# EAGLE design U96-SVM (EAGLE 9.6.2)

## Sheet 1 of 2
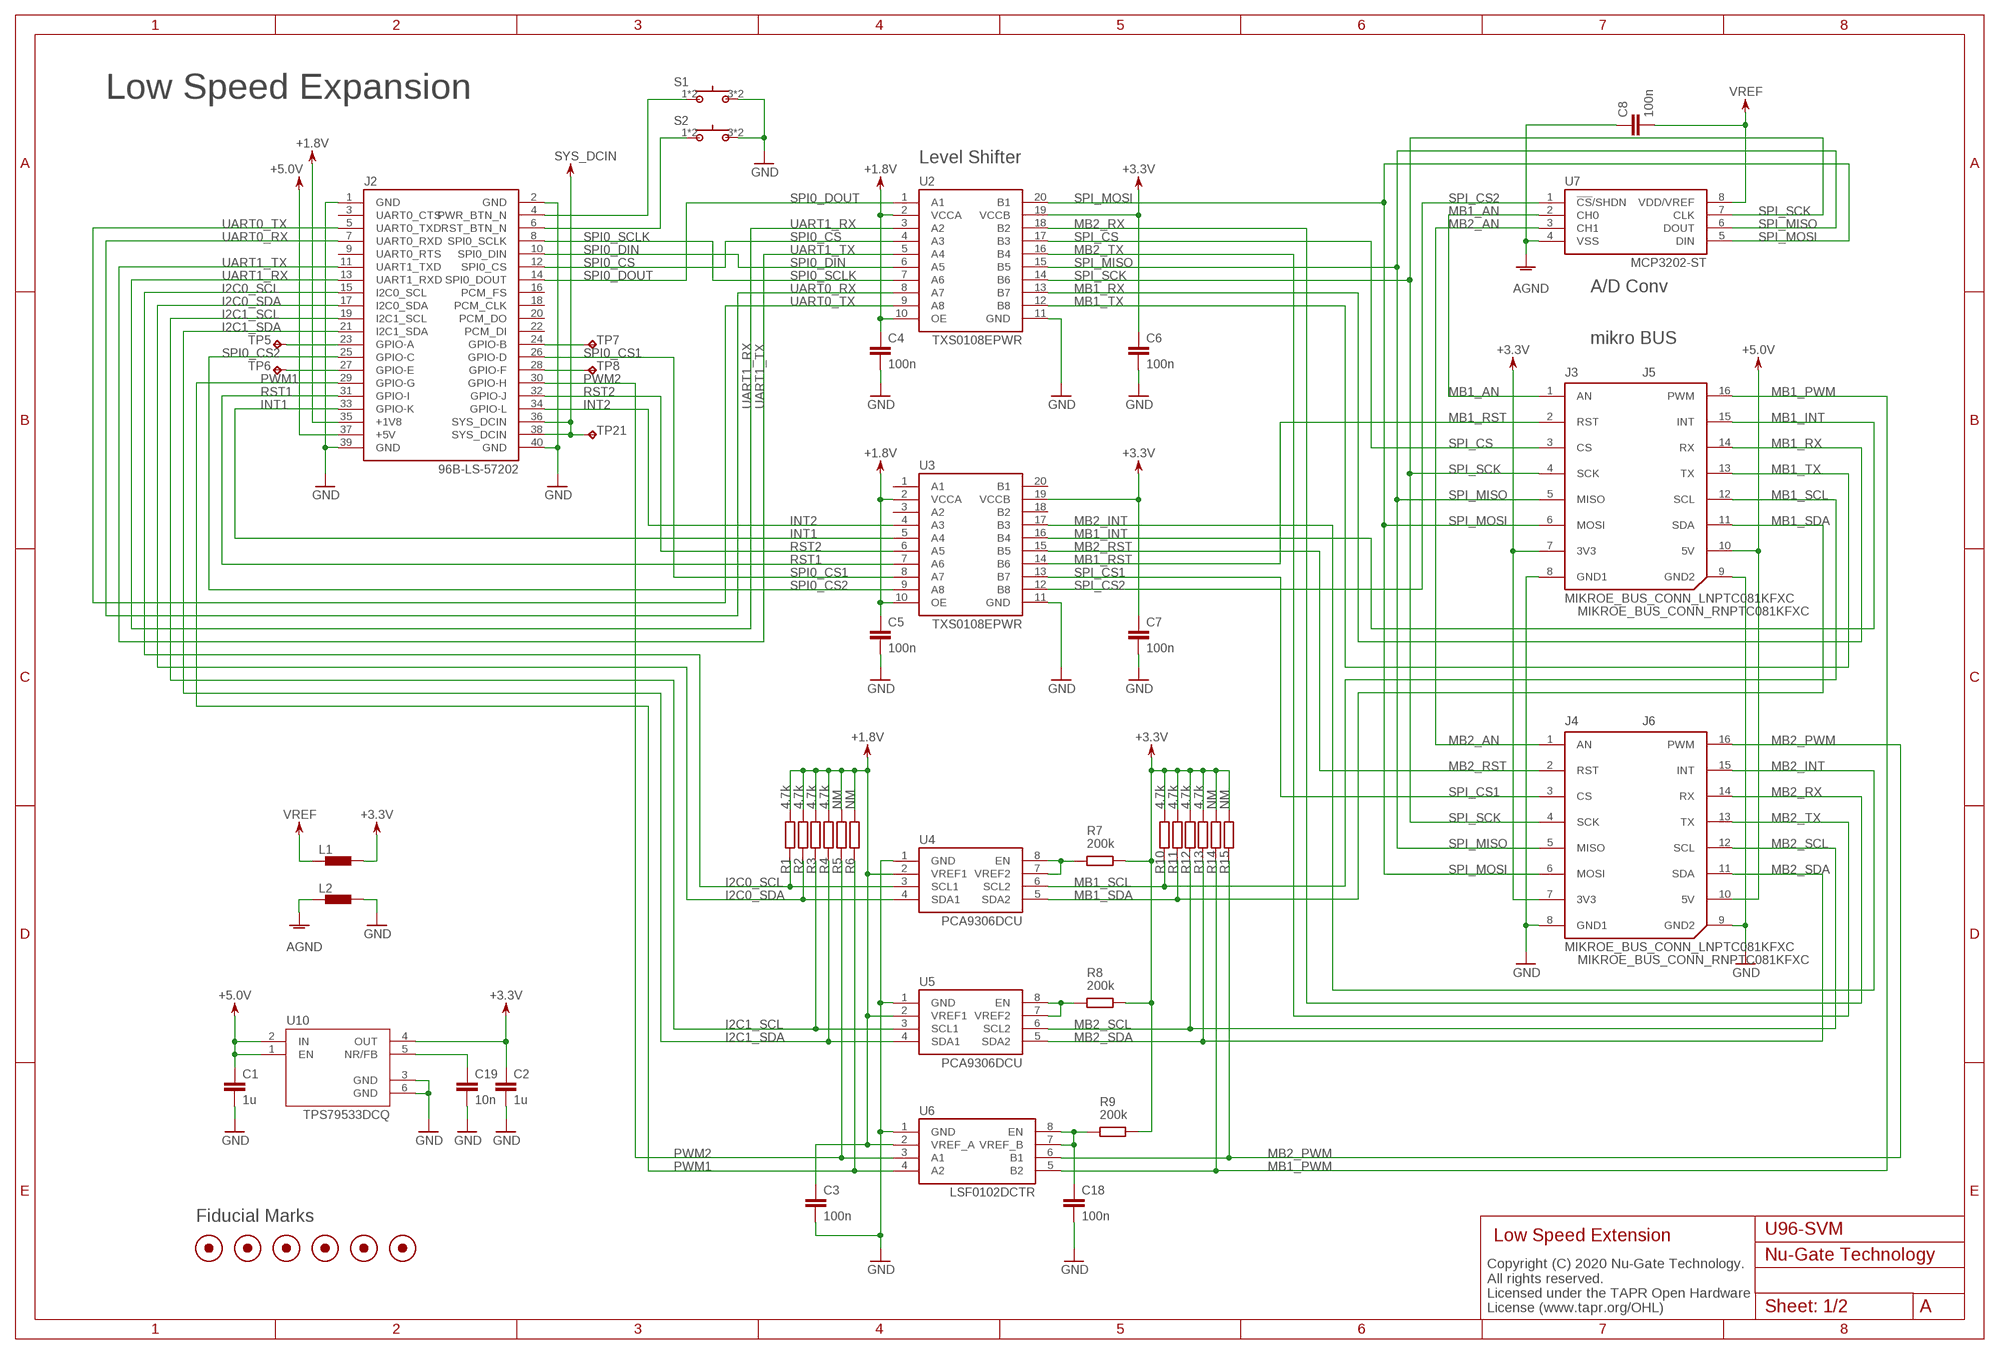
[diagram p0: schematic, sheet 1]
FRAME1 (A3L-LOC): EDITOR: Nu-Gate Technology; PAGE_TITLE: Low Speed Extension; PROJECT_NAME: U96-SVM; REV: A

### Parts
C1  1u  C-EUC0402  [C0402]
C2  1u  C-EUC0402  [C0402]
C3  100n  C-EUC0402  [C0402]
C4  100n  C-EUC0402  [C0402]
C5  100n  C-EUC0402  [C0402]
C6  100n  C-EUC0402  [C0402]
C7  100n  C-EUC0402  [C0402]
C8  100n  C-EUC0402  [C0402]
C18  100n  C-EUC0402  [C0402]
C19  10n  C-EUC0402  [C0402]
FID1  FIDUCIAL  [FIDUCIAL_1MM]
FID2  FIDUCIAL  [FIDUCIAL_1MM]
FID3  FIDUCIAL  [FIDUCIAL_1MM]
FID4  FIDUCIAL  [FIDUCIAL_1MM]
FID5  FIDUCIAL  [FIDUCIAL_1MM]
FID6  FIDUCIAL  [FIDUCIAL_1MM]
J2  96B-LS-57202  [57202-G52-20LF]
J3  MIKROE_BUS_CONN_LNPTC081KFXC  [MIKROBUS_HOST_CONN_L2]
J4  MIKROE_BUS_CONN_LNPTC081KFXC  [MIKROBUS_HOST_CONN_L2]
J5  MIKROE_BUS_CONN_RNPTC081KFXC  [MIKROBUS_HOST_CONN_R2]
J6  MIKROE_BUS_CONN_RNPTC081KFXC  [MIKROBUS_HOST_CONN_R2]
L1  BLM15AX  [0402]
L2  BLM15AX  [0402]
R1  4.7k  R-EU_R0402  [R0402]
R2  4.7k  R-EU_R0402  [R0402]
R3  4.7k  R-EU_R0402  [R0402]
R4  4.7k  R-EU_R0402  [R0402]
R5  NM  R-EU_R0402  [R0402]
R6  NM  R-EU_R0402  [R0402]
R7  200k  R-EU_R0402  [R0402]
R8  200k  R-EU_R0402  [R0402]
R9  200k  R-EU_R0402  [R0402]
R10  4.7k  R-EU_R0402  [R0402]
R11  4.7k  R-EU_R0402  [R0402]
R12  4.7k  R-EU_R0402  [R0402]
R13  4.7k  R-EU_R0402  [R0402]
R14  NM  R-EU_R0402  [R0402]
R15  NM  R-EU_R0402  [R0402]
S1  430181038816  [430181038816]
S2  430181038816  [430181038816]
TP5  TPB1,27  [B1,27]
TP6  TPB1,27  [B1,27]
TP7  TPB1,27  [B1,27]
TP8  TPB1,27  [B1,27]
TP21  TPB1,27  [B1,27]
U2  TXS0108EPWR  [TI-PW20]
U3  TXS0108EPWR  [TI-PW20]
U4  PCA9306DCU  [TI-DCU8]
U5  PCA9306DCU  [TI-DCU8]
U6  LSF0102DCTR  [TI-DCT8]
U7  MCP3202-ST  [MC-ST8]
U10  TPS79533DCQ  [TI-SOT223]

### Nets
+1.8V: C3.1 C4.1 C5.1 J2.35(+1V8) R1.2 R2.2 R3.2 R4.2 R5.2 R6.2 U2.2(VCCA) U2.10(OE) U3.2(VCCA) U3.10(OE) U4.2(VREF1) U5.2(VREF1) U6.2(VREF_A) ; also sheet 2
+3.3V: C2.1 C6.1 C7.1 J3.7(3V3) J4.7(3V3) L1.2 R7.2 R8.2 R9.2 R10.2 R11.2 R12.2 R13.2 R14.2 R15.2 U2.19(VCCB) U3.19(VCCB) U10.4(OUT) ; also sheet 2
+5.0V: C1.1 J2.37(+5V) J5.10(5V) J6.10(5V) U10.1(EN) U10.2(IN) ; also sheet 2
AGND: C8.1 L2.1 U7.4(VSS)
GND: C1.2 C2.2 C3.2 C4.2 C5.2 C6.2 C7.2 C18.2 C19.2 J2.1(GND) J2.2(GND) J2.39(GND) J2.40(GND) J3.8(GND1) J4.8(GND1) J5.9(GND2) J6.9(GND2) L2.2 S1.3 S1.4 S2.3 S2.4 U2.11(GND) U3.11(GND) U4.1(GND) U5.1(GND) U6.1(GND) U10.3(GND) U10.6(GND) ; also sheet 2
I2C0_SCL: J2.15(I2C0_SCL) R1.1 U4.3(SCL1)
I2C0_SDA: J2.17(I2C0_SDA) R2.1 U4.4(SDA1)
I2C1_SCL: J2.19(I2C1_SCL) R3.1 U5.3(SCL1)
I2C1_SDA: J2.21(I2C1_SDA) R4.1 U5.4(SDA1)
INT1: J2.33(GPIO-K) U3.5(A4)
INT2: J2.34(GPIO-L) U3.4(A3)
MB1_AN: J3.1(AN) U7.2(CH0)
MB1_INT: J5.15(INT) U3.16(B4)
MB1_PWM: J5.16(PWM) R14.1 U6.5(B2)
MB1_RST: J3.2(RST) U3.14(B6)
MB1_RX: J5.14(RX) U2.13(B7)
MB1_SCL: J5.12(SCL) R10.1 U4.6(SCL2)
MB1_SDA: J5.11(SDA) R11.1 U4.5(SDA2)
MB1_TX: J5.13(TX) U2.12(B8)
MB2_AN: J4.1(AN) U7.3(CH1)
MB2_INT: J6.15(INT) U3.17(B3)
MB2_PWM: J6.16(PWM) R15.1 U6.6(B1)
MB2_RST: J4.2(RST) U3.15(B5)
MB2_RX: J6.14(RX) U2.18(B2)
MB2_SCL: J6.12(SCL) R12.1 U5.6(SCL2)
MB2_SDA: J6.11(SDA) R13.1 U5.5(SDA2)
MB2_TX: J6.13(TX) U2.16(B4)
N$5: R7.1 U4.7(VREF2) U4.8(EN)
N$6: C18.1 R9.1 U6.7(VREF_B) U6.8(EN)
N$7: R8.1 U5.7(VREF2) U5.8(EN)
N$8: C19.1 U10.5(NR/FB)
N$10: J2.23(GPIO-A) TP5.TP
N$11: J2.4(PWR_BTN_N) S1.1 S1.2
N$12: J2.6(RST_BTN_N) S2.1 S2.2
N$13: J2.27(GPIO-E) TP6.TP
N$14: J2.24(GPIO-B) TP7.TP
N$15: J2.28(GPIO-F) TP8.TP
PWM1: J2.29(GPIO-G) R6.1 U6.4(A2)
PWM2: J2.30(GPIO-H) R5.1 U6.3(A1)
RST1: J2.31(GPIO-I) U3.7(A6)
RST2: J2.32(GPIO-J) U3.6(A5)
SPI0_CS: J2.12(SPI0_CS) U2.4(A3)
SPI0_CS1: J2.26(GPIO-D) U3.8(A7)
SPI0_CS2: J2.25(GPIO-C) U3.9(A8)
SPI0_DIN: J2.10(SPI0_DIN) U2.6(A5)
SPI0_DOUT: J2.14(SPI0_DOUT) U2.1(A1)
SPI0_SCLK: J2.8(SPI0_SCLK) U2.7(A6)
SPI_CS: J3.3(CS) U2.17(B3)
SPI_CS1: J4.3(CS) U3.13(B7)
SPI_CS2: U3.12(B8) U7.1(!CS!/SHDN)
SPI_MISO: J3.5(MISO) J4.5(MISO) U2.15(B5) U7.6(DOUT)
SPI_MOSI: J3.6(MOSI) J4.6(MOSI) U2.20(B1) U7.5(DIN)
SPI_SCK: J3.4(SCK) J4.4(SCK) U2.14(B6) U7.7(CLK)
SYS_DCIN: J2.36(SYS_DCIN) J2.38(SYS_DCIN) TP21.TP
UART0_RX: J2.7(UART0_RXD) U2.8(A7)
UART0_TX: J2.5(UART0_TXD) U2.9(A8)
UART1_RX: J2.13(UART1_RXD) U2.3(A2)
UART1_TX: J2.11(UART1_TXD) U2.5(A4)
VREF: C8.2 L1.1 U7.8(VDD/VREF)
Unconnected: J2.3(UART0_CTS) J2.9(UART0_RTS) J2.16(PCM_FS) J2.18(PCM_CLK) J2.20(PCM_DO) J2.22(PCM_DI) U3.1(A1) U3.3(A2) U3.18(B2) U3.20(B1)

### Notes on the sheet
- Low Speed Expansion
- Level Shifter
- A/D Conv
- mikro BUS
- Fiducial Marks
- Copyright (C) 2020 Nu-Gate Technology.
  All rights reserved.
  Licensed under the TAPR Open Hardware
  License (www.tapr.org/OHL)

## Sheet 2 of 2
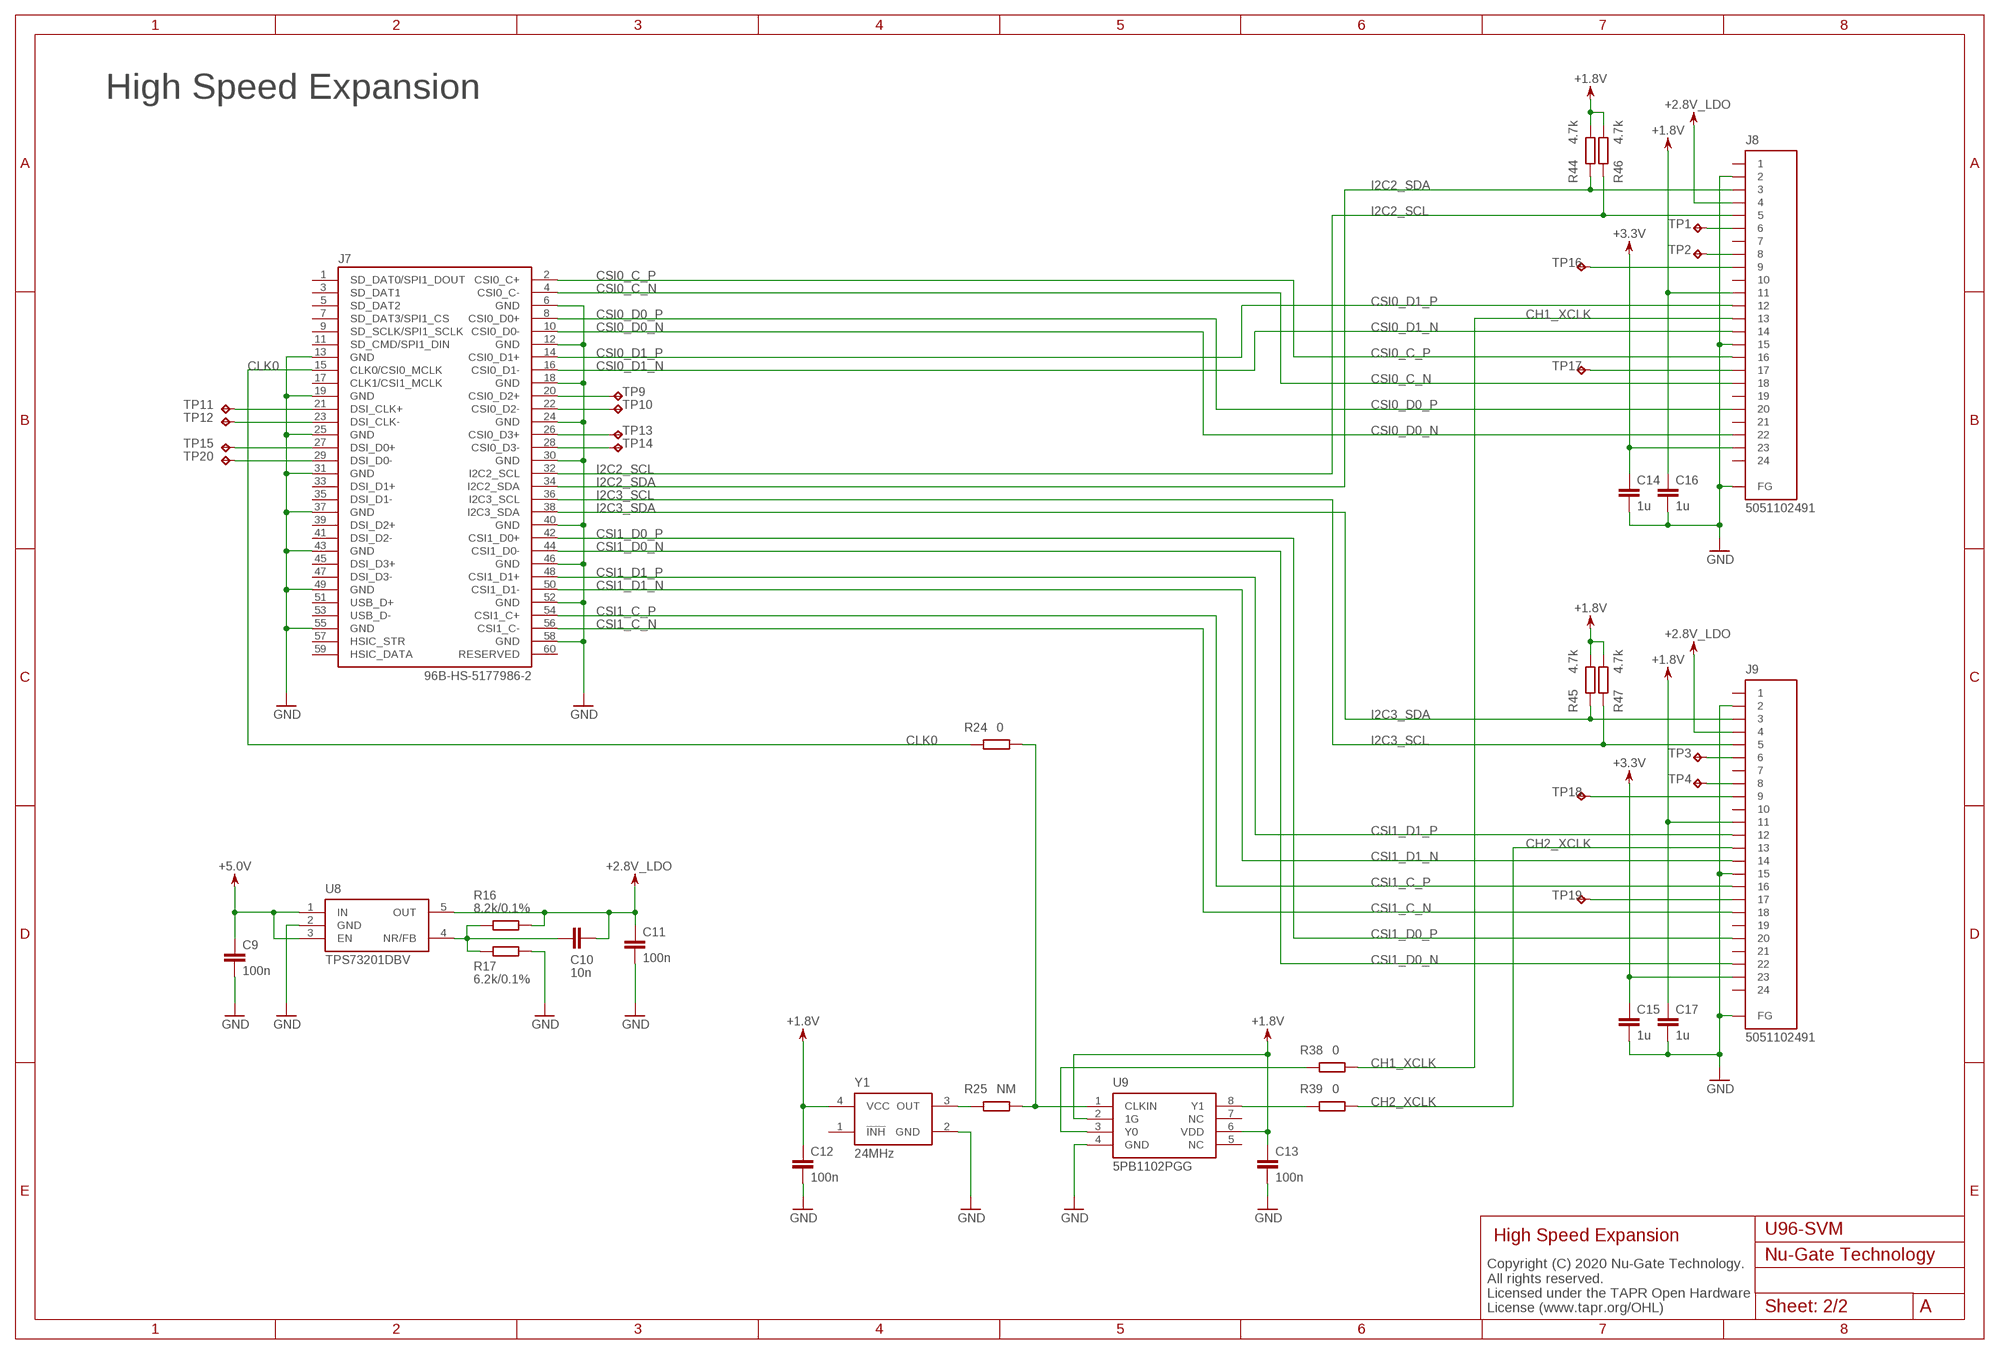
[diagram p1: schematic, sheet 2]
FRAME3 (A3L-LOC): EDITOR: Nu-Gate Technology; PAGE_TITLE: High Speed Expansion; PROJECT_NAME: U96-SVM; REV: A

### Parts
C9  100n  C-EUC0402  [C0402]
C10  10n  C-EUC0402  [C0402]
C11  100n  C-EUC0402  [C0402]
C12  100n  C-EUC0402  [C0402]
C13  100n  C-EUC0402  [C0402]
C14  1u  C-EUC0402  [C0402]
C15  1u  C-EUC0402  [C0402]
C16  1u  C-EUC0402  [C0402]
C17  1u  C-EUC0402  [C0402]
J7  96B-HS-5177986-2  [5177986-2]
J8  5051102491  [MO-5051102491]
J9  5051102491  [MO-5051102491]
R16  8.2k/0.1%  R-EU_R0402  [R0402]
R17  6.2k/0.1%  R-EU_R0402  [R0402]
R24  0  R-EU_R0402  [R0402]
R25  NM  R-EU_R0402  [R0402]
R38  0  R-EU_R0402  [R0402]
R39  0  R-EU_R0402  [R0402]
R44  4.7k  R-EU_R0402  [R0402]
R45  4.7k  R-EU_R0402  [R0402]
R46  4.7k  R-EU_R0402  [R0402]
R47  4.7k  R-EU_R0402  [R0402]
TP1  TPB1,27  [B1,27]
TP2  TPB1,27  [B1,27]
TP3  TPB1,27  [B1,27]
TP4  TPB1,27  [B1,27]
TP9  TPB1,27  [B1,27]
TP10  TPB1,27  [B1,27]
TP11  TPB1,27  [B1,27]
TP12  TPB1,27  [B1,27]
TP13  TPB1,27  [B1,27]
TP14  TPB1,27  [B1,27]
TP15  TPB1,27  [B1,27]
TP16  TPB1,27  [B1,27]
TP17  TPB1,27  [B1,27]
TP18  TPB1,27  [B1,27]
TP19  TPB1,27  [B1,27]
TP20  TPB1,27  [B1,27]
U8  TPS73201DBV  [TI-SOT23]
U9  5PB1102PGG  [ID-TSSOP8]
Y1  24MHz  KC2520Z  [KC2520Z]

### Nets
+1.8V: C12.1 C13.1 C16.1 C17.1 J8.11 J9.11 R44.2 R45.2 R46.2 R47.2 U9.2(1G) U9.6(VDD) Y1.4(VCC) ; also sheet 1
+2.8V_LDO: C10.2 C11.1 J8.4 J9.4 R16.2 U8.5(OUT)
+3.3V: C14.1 C15.1 J8.23 J9.23 ; also sheet 1
+5.0V: C9.1 U8.1(IN) U8.3(EN) ; also sheet 1
CH1_XCLK: J8.13 R38.2
CH2_XCLK: J9.13 R39.2
CLK0: J7.15(CLK0/CSI0_MCLK) R24.1
CSI0_C_N [lvds]: J7.4(CSI0_C-) J8.18
CSI0_C_P [lvds]: J7.2(CSI0_C+) J8.16
CSI0_D0_N [lvds]: J7.10(CSI0_D0-) J8.22
CSI0_D0_P [lvds]: J7.8(CSI0_D0+) J8.20
CSI0_D1_N [lvds]: J7.16(CSI0_D1-) J8.14
CSI0_D1_P [lvds]: J7.14(CSI0_D1+) J8.12
CSI1_C_N [lvds]: J7.56(CSI1_C-) J9.18
CSI1_C_P [lvds]: J7.54(CSI1_C+) J9.16
CSI1_D0_N [lvds]: J7.44(CSI1_D0-) J9.22
CSI1_D0_P [lvds]: J7.42(CSI1_D0+) J9.20
CSI1_D1_N [lvds]: J7.50(CSI1_D1-) J9.14
CSI1_D1_P [lvds]: J7.48(CSI1_D1+) J9.12
GND: C9.2 C11.2 C12.2 C13.2 C14.2 C15.2 C16.2 C17.2 J7.6(GND) J7.12(GND) J7.13(GND) J7.18(GND) J7.19(GND) J7.24(GND) J7.25(GND) J7.30(GND) J7.31(GND) J7.37(GND) J7.40(GND) J7.43(GND) J7.46(GND) J7.49(GND) J7.52(GND) J7.55(GND) J7.58(GND) J8.2 J8.15 J8.FG@1(FG) J8.FG@2(FG) J9.2 J9.15 J9.FG@1(FG) J9.FG@2(FG) R17.2 U8.2(GND) U9.4(GND) Y1.2(GND) ; also sheet 1
I2C2_SCL: J7.32(I2C2_SCL) J8.5 R46.1
I2C2_SDA: J7.34(I2C2_SDA) J8.3 R44.1
I2C3_SCL: J7.36(I2C3_SCL) J9.5 R47.1
I2C3_SDA: J7.38(I2C3_SDA) J9.3 R45.1
N$1: J8.6 TP1.TP
N$2: J8.8 TP2.TP
N$3: J9.6 TP3.TP
N$4: J9.8 TP4.TP
N$9: C10.1 R16.1 R17.1 U8.4(NR/FB)
N$16: J7.21(DSI_CLK+) TP11.TP
N$17: J7.23(DSI_CLK-) TP12.TP
N$18: J7.27(DSI_D0+) TP15.TP
N$19: J7.29(DSI_D0-) TP20.TP
N$20: J7.20(CSI0_D2+) TP9.TP
N$21: J7.22(CSI0_D2-) TP10.TP
N$22: J7.26(CSI0_D3+) TP13.TP
N$23: J7.28(CSI0_D3-) TP14.TP
N$37: R25.1 Y1.3(OUT)
N$38: R24.2 R25.2 U9.1(CLKIN)
N$39: R39.1 U9.8(Y1)
N$40: R38.1 U9.3(Y0)
N$59: J8.9 TP16.TP
N$60: J8.17 TP17.TP
N$61: J9.9 TP18.TP
N$62: J9.17 TP19.TP
Unconnected: J7.1(SD_DAT0/SPI1_DOUT) J7.3(SD_DAT1) J7.5(SD_DAT2) J7.7(SD_DAT3/SPI1_CS) J7.9(SD_SCLK/SPI1_SCLK) J7.11(SD_CMD/SPI1_DIN) J7.17(CLK1/CSI1_MCLK) J7.33(DSI_D1+) J7.35(DSI_D1-) J7.39(DSI_D2+) J7.41(DSI_D2-) J7.45(DSI_D3+) J7.47(DSI_D3-) J7.51(USB_D+) J7.53(USB_D-) J7.57(HSIC_STR) J7.59(HSIC_DATA) J7.60(RESERVED) J8.1 J8.7 J8.10 J8.19 J8.21 J8.24 J9.1 J9.7 J9.10 J9.19 J9.21 J9.24 U9.5(NC) U9.7(NC) Y1.1(!INH)

### Notes on the sheet
- High Speed Expansion
- Copyright (C) 2020 Nu-Gate Technology.
  All rights reserved.
  Licensed under the TAPR Open Hardware
  License (www.tapr.org/OHL)

## Library data of the parts
C1-C19 = rcl:C-EU: CAPACITOR, European symbol; SPICEPREFIX: C
FID1-FID6 = U96-SVM:FIDUCIAL: For use by pick and place machines to calibrate the vision/machine, 1mm By microbuilder.eu
J2 = U96-SVM:96B-LS-57202
J3 J4 = U96-SVM:MIKROE_BUS_CONN_L
J5 J6 = U96-SVM:MIKROE_BUS_CONN_R
J7 = U96-SVM:96B-HS-5177986-2
J8 J9 = U96-SVM:5051102491: 0.5mm pitch, 24 circuit FPC connector
L1 L2 = U96-SVM:BLM15: EMIFIL (R) Chip Ferrite Bead for GHz Noise Source: http://www.murata.com/ Ferrite Bead BLM15H.pdf
R1-R17 R24 R25 R38 R39 R44-R47 = rcl:R-EU_: RESISTOR, European symbol; SPICEPREFIX: R
S1 S2 = U96-SVM:430181038816: 4.5x4.5 mm SMD WS-TASV <http://katalog.we-online.de/media/images/v2/Family_WS-TASV_SMD_Tact_Switch_430181038816.jpg> Details see: http://katalog.we-online.de/en/em/TASV_4_5X4_5_SMD/430181038816
TP1-TP21 = testpad:TP: Test pad
U2 U3 = U96-SVM:TXS0108EPWR
U4 U5 = U96-SVM:PCA9306DCU
U6 = U96-SVM:LSF0102DCTR
U7 = U96-SVM:MCP3202-ST
U8 = U96-SVM:TPS732*DBV: LDO 250mA TPS732xx yyy z xx: nominal output voltage (25 = 2.5V; 01 = adjustable) yyy: package designator (DBV = SOT-23) z: tape and reel quantity (R = 3000, T = 250)
U9 = U96-SVM:5PB1102PGG: IDT 1.8V to 3.3V LVCMOS Clock Buffer
U10 = U96-SVM:TPS79533DCQ
Y1 = U96-SVM:KC2520Z

## Net classes
1 lvds: width 0.32 mm, drill 0.25 mm, clearance 0.18 mm

## Board
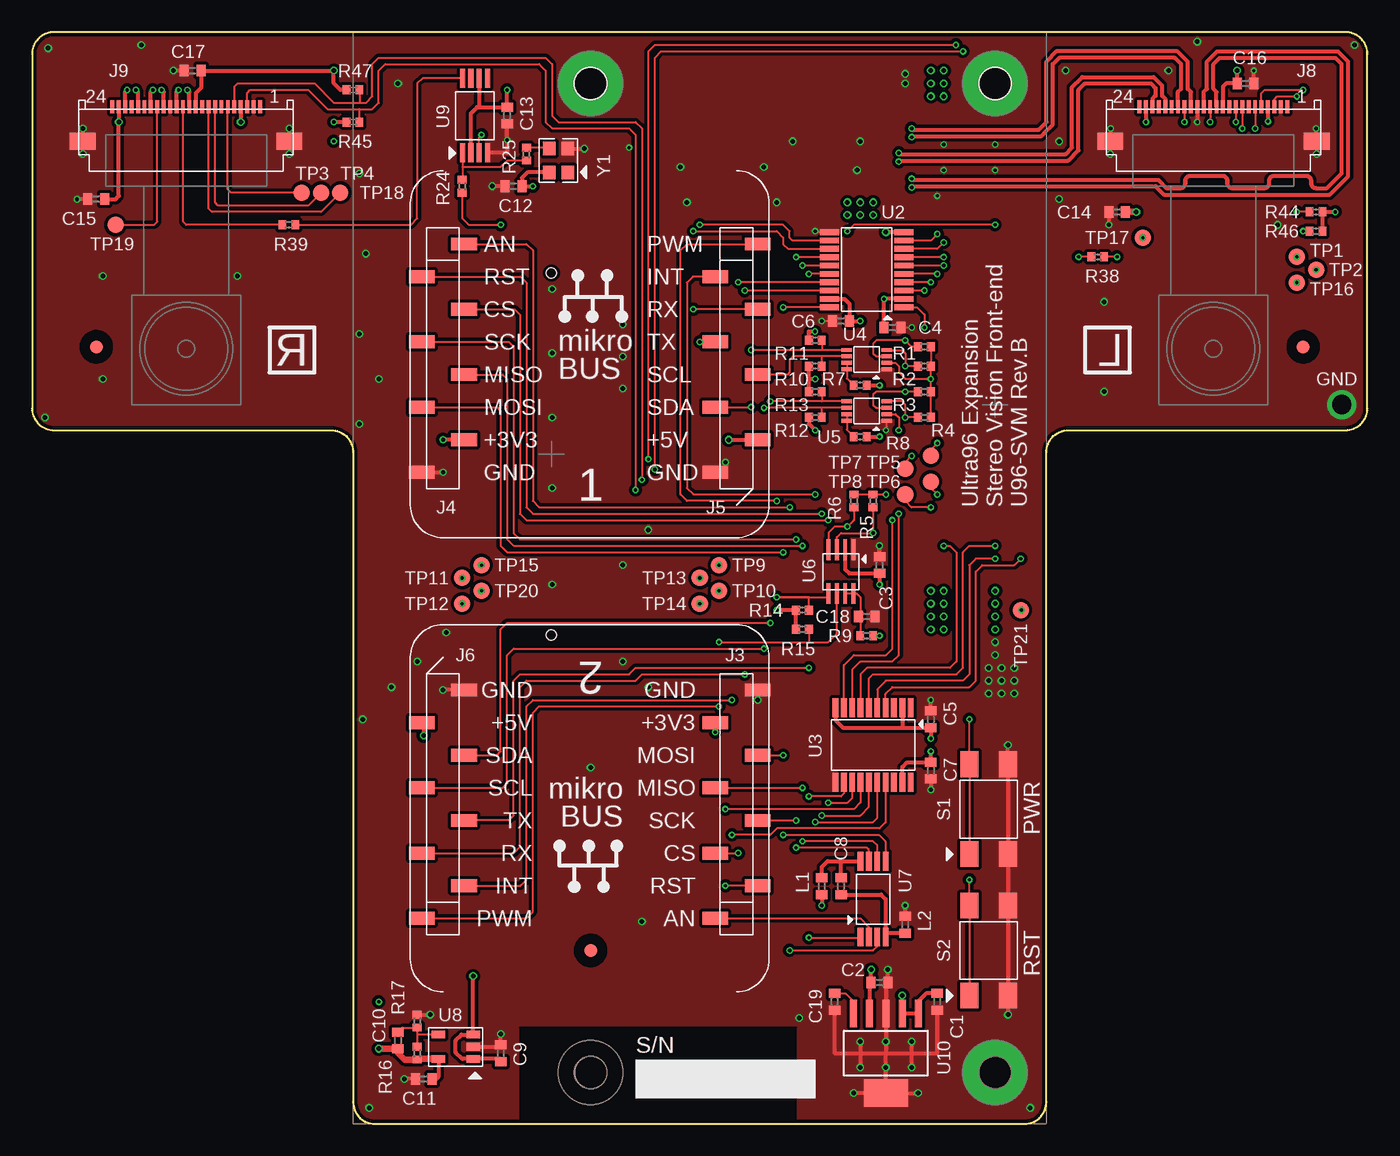
[diagram p2: board, top side]
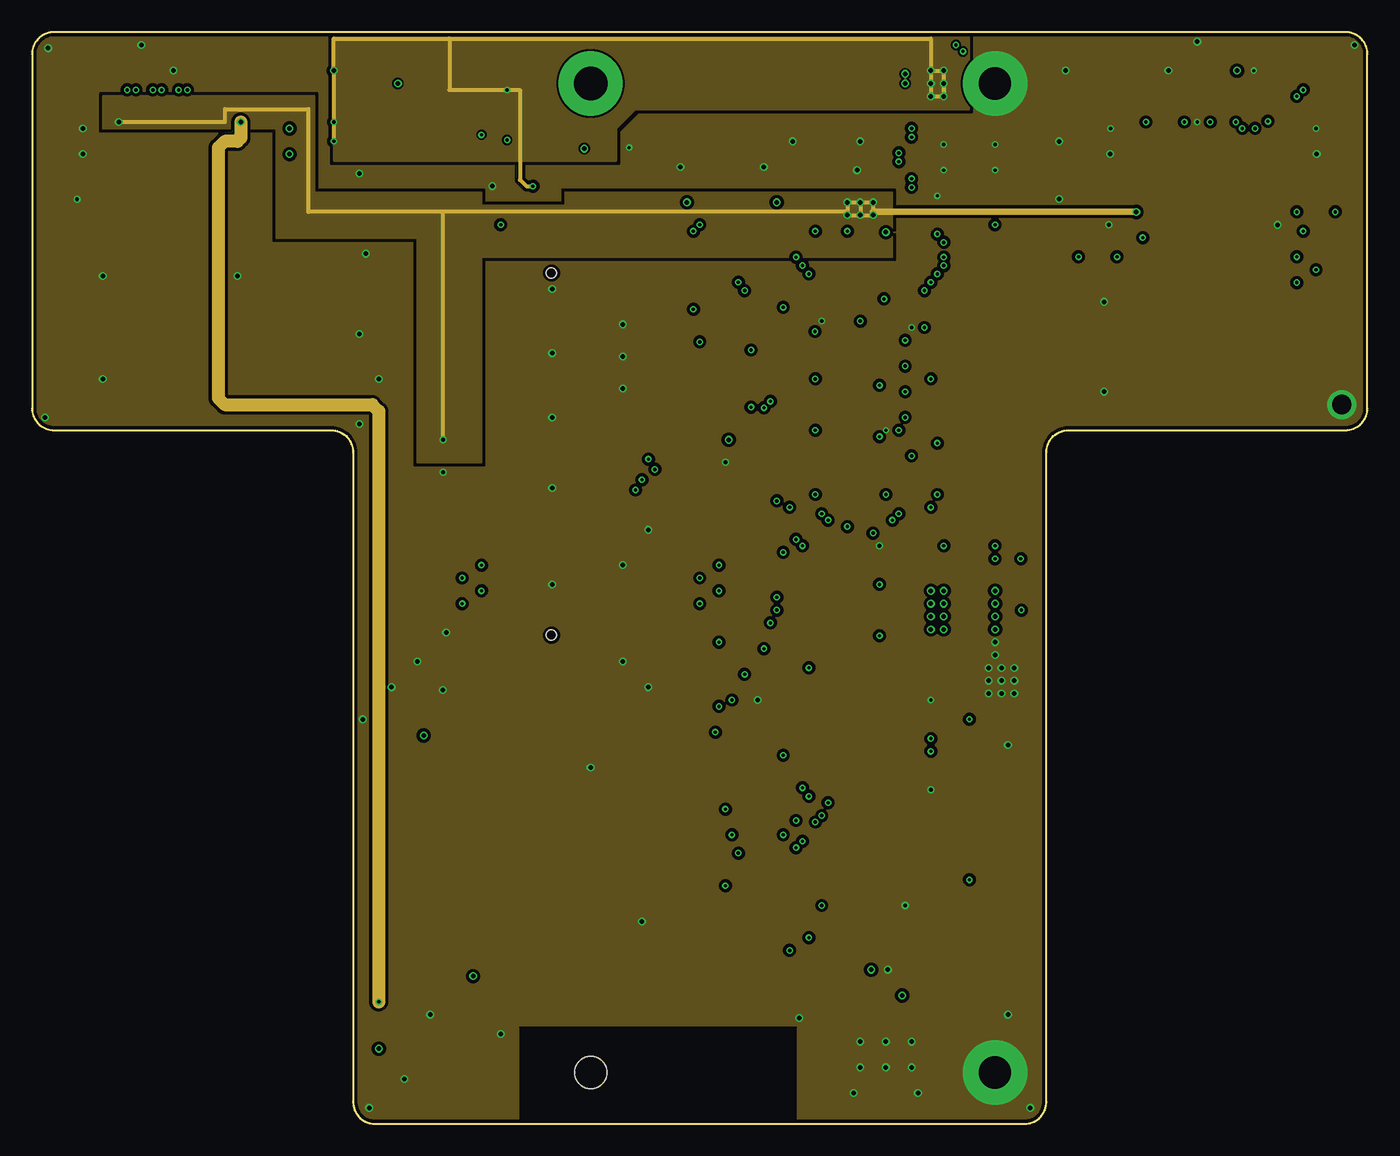
[diagram p3: board, inner layer Route2]
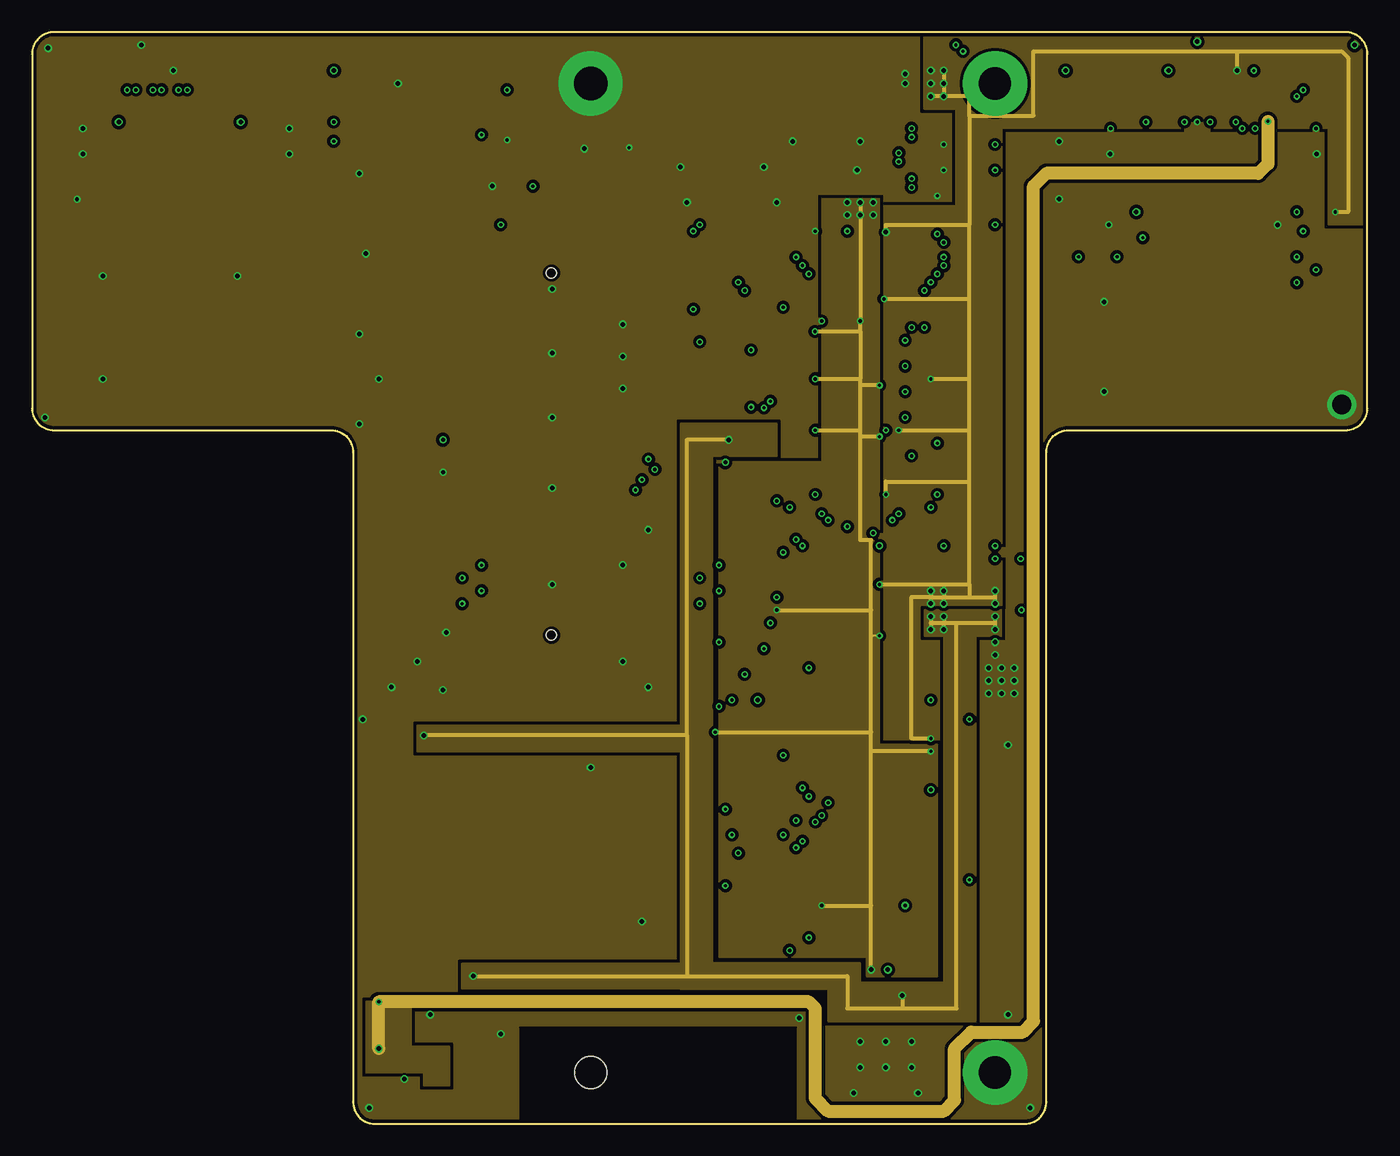
[diagram p4: board, inner layer Route3]
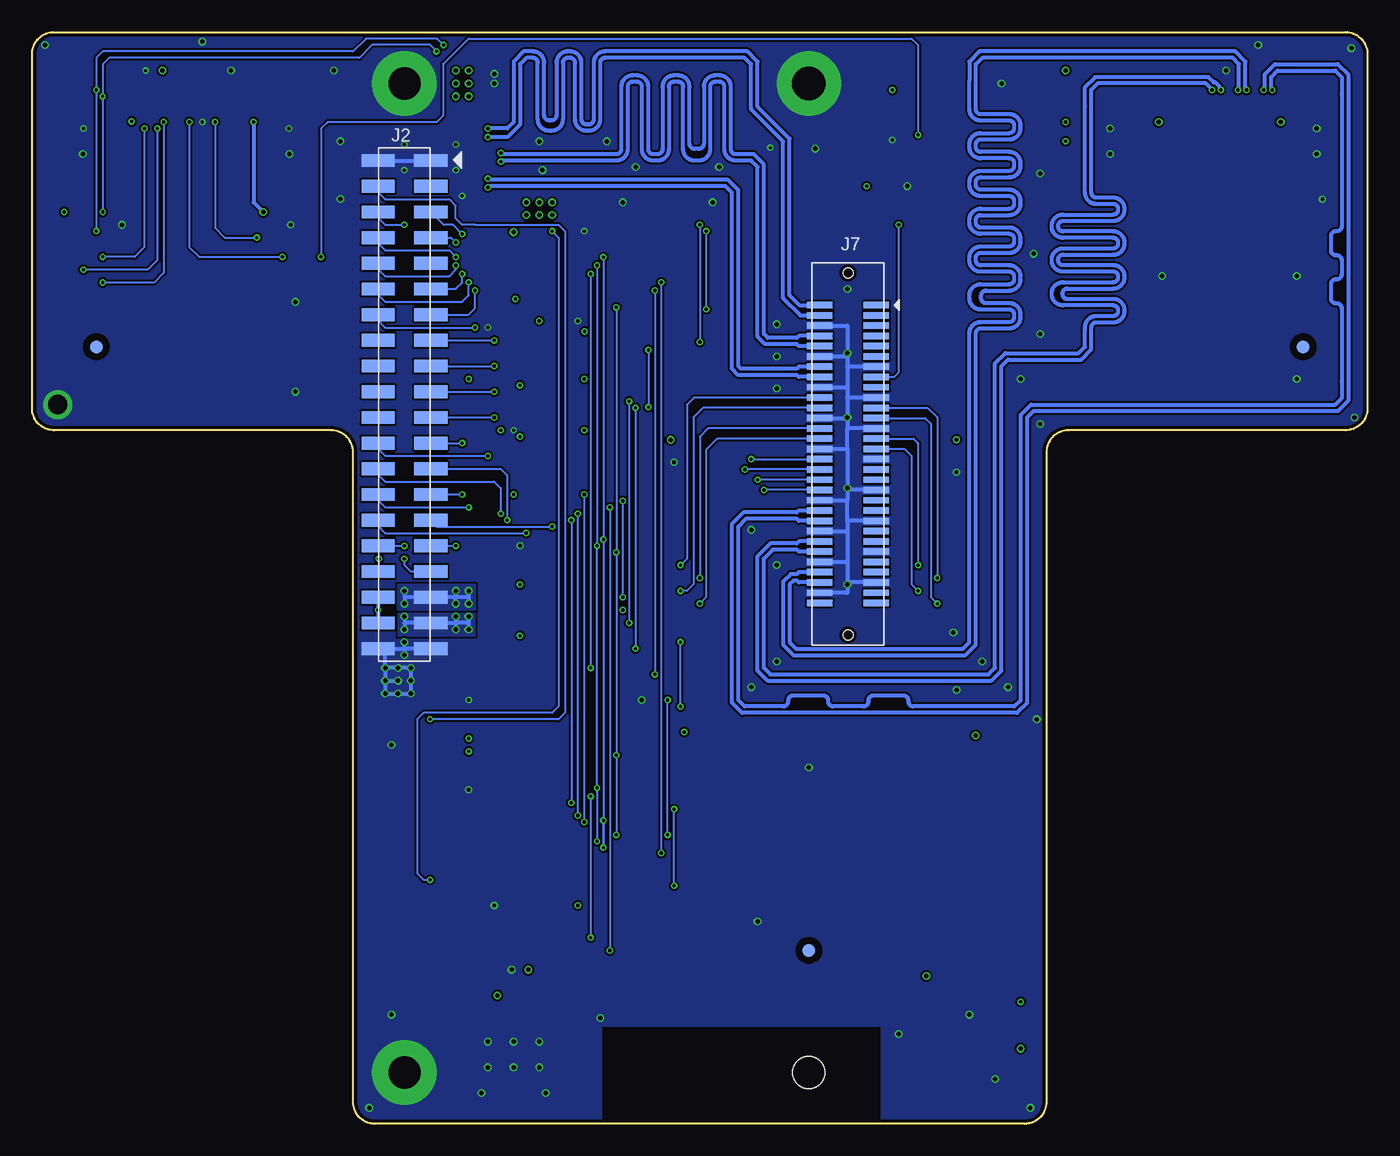
[diagram p5: board, bottom side, seen from below]

Size 104 x 85 mm. Coordinates in mm from the lower left corner, seen from the top.
Outline: 1.71,54 23.29,54 arc-90 25,52.29 25,1.71 arc90 26.71,0 77.29,0 arc90 79,1.71 79,52.29 arc-90 80.71,54 102.29,54 arc90 104,55.71 104,83.29 arc90 102.29,85 1.71,85 arc90 0,83.29 0,55.71 arc90 1.71,54
Copper layers (1+2*3+16): Top 0.018mm / dielectric 0.36mm / Route2 0.035mm / dielectric 0.71mm / Route3 0.035mm / dielectric 0.36mm / Bottom 0.018mm
Design rules "eC_4Layer_PClass6_BaseCopperO18-I35_drill0.25": minimum track width 0.15mm, minimum drill 0.25mm, track to track 0.15mm, track to pad 0.15mm, pad to pad 0.15mm, via to via 0.15mm, smd to smd 0mil, copper to edge 0.25mm, drill to drill 0.35mm, minimum pad ring 0.175mm, minimum via ring 0.125mm, stop-mask expansion 0mil, vias tented up to drill 0.45mm, thermal gap 0.2mm
Holes 2.5 mm at 43.5,4

### Footprints (pad centres in the part's own frame; a part is rotated, then mirrored left to right if it is on the bottom)
C0402 = smd 0.7 x 0.9: 1 -0.65,0; 2 0.65,0
FIDUCIAL_1MM = smd 1 x 1: 1 0,0
57202-G52-20LF = smd 1 x 2.6: 1 -19,2.05; 2 -19,-2.05; 3 -17,2.05; 4 -17,-2.05; 5 -15,2.05; 6 -15,-2.05; 7 -13,2.05; 8 -13,-2.05; 9 -11,2.05; 10 -11,-2.05; 11 -9,2.05; 12 -9,-2.05; 13 -7,2.05; 14 -7,-2.05; 15 -5,2.05; 16 -5,-2.05; 17 -3,2.05; 18 -3,-2.05; 19 -1,2.05; 20 -1,-2.05; 21 1,2.05; 22 1,-2.05; 23 3,2.05; 24 3,-2.05; 25 5,2.05; 26 5,-2.05; 27 7,2.05; 28 7,-2.05; 29 9,2.05; 30 9,-2.05; 31 11,2.05; 32 11,-2.05; 33 13,2.05; 34 13,-2.05; 35 15,2.05; 36 15,-2.05; 37 17,2.05; 38 17,-2.05; 39 19,2.05; 40 19,-2.05
MIKROBUS_HOST_CONN_L2 = smd 2 x 1: 1 1.65,0; 2 -1.65,-2.54; 3 1.65,-5.08; 4 -1.65,-7.62; 5 1.65,-10.16; 6 -1.65,-12.7; 7 1.65,-15.24; 8 -1.65,-17.78
MIKROBUS_HOST_CONN_R2 = smd 2 x 1: 9 -1.65,-17.78; 10 1.65,-15.24; 11 -1.65,-12.7; 12 1.65,-10.16; 13 -1.65,-7.62; 14 1.65,-5.08; 15 -1.65,-2.54; 16 1.65,0
5177986-2 = smd 0.5 x 2: 1 -11.6,2.2; 2 -11.6,-2.2; 3 -10.8,2.2; 4 -10.8,-2.2; 5 -10,2.2; 6 -10,-2.2; 7 -9.2,2.2; 8 -9.2,-2.2; 9 -8.4,2.2; 10 -8.4,-2.2; 11 -7.6,2.2; 12 -7.6,-2.2; 13 -6.8,2.2; 14 -6.8,-2.2; 15 -6,2.2; 16 -6,-2.2; 17 -5.2,2.2; 18 -5.2,-2.2; 19 -4.4,2.2; 20 -4.4,-2.2; 21 -3.6,2.2; 22 -3.6,-2.2; 23 -2.8,2.2; 24 -2.8,-2.2; 25 -2,2.2; 26 -2,-2.2; 27 -1.2,2.2; 28 -1.2,-2.2; 29 -0.4,2.2; 30 -0.4,-2.2; 31 0.4,2.2; 32 0.4,-2.2; 33 1.2,2.2; 34 1.2,-2.2; 35 2,2.2; 36 2,-2.2; 37 2.8,2.2; 38 2.8,-2.2; 39 3.6,2.2; 40 3.6,-2.2; 41 4.4,2.2; 42 4.4,-2.2; 43 5.2,2.2; 44 5.2,-2.2; 45 6,2.2; 46 6,-2.2; 47 6.8,2.2; 48 6.8,-2.2; 49 7.6,2.2; 50 7.6,-2.2; 51 8.4,2.2; 52 8.4,-2.2; 53 9.2,2.2; 54 9.2,-2.2; 55 10,2.2; 56 10,-2.2; 57 10.8,2.2; 58 10.8,-2.2; 59 11.6,2.2; 60 11.6,-2.2 | hole 0.8: -14.1,0; 14.1,0
MO-5051102491 = smd 0.3 x 1: 1 5.75,2.7; 2 5.25,2.7; 3 4.75,2.7; 4 4.25,2.7; 5 3.75,2.7; 6 3.25,2.7; 7 2.75,2.7; 8 2.25,2.7; 9 1.75,2.7; 10 1.25,2.7; 11 0.75,2.7; 12 0.25,2.7; 13 -0.25,2.7; 14 -0.75,2.7; 15 -1.25,2.7; 16 -1.75,2.7; 17 -2.25,2.7; 18 -2.75,2.7; 19 -3.25,2.7; 20 -3.75,2.7; 21 -4.25,2.7; 22 -4.75,2.7; 23 -5.25,2.7; 24 -5.75,2.7 | smd 2 x 1.3: FG@1 -8.05,0; FG@2 8.05,0
0402 = smd 0.7 x 0.9: 1 -0.65,0; 2 0.65,0
R0402 = smd 0.6 x 0.7: 1 -0.5,0; 2 0.5,0
430181038816 = smd 2 x 1.4: 1 -3.5,1.5; 2 3.5,1.5; 3 -3.5,-1.5; 4 3.5,-1.5
B1,27 = smd 1.27 x 1.27: TP 0,0
TI-PW20 = smd 1.5 x 0.45: 1 -2.9,2.925; 2 -2.9,2.275; 3 -2.9,1.625; 4 -2.9,0.975; 5 -2.9,0.325; 6 -2.9,-0.325; 7 -2.9,-0.975; 8 -2.9,-1.625; 9 -2.9,-2.275; 10 -2.9,-2.925; 11 2.9,-2.925; 12 2.9,-2.275; 13 2.9,-1.625; 14 2.9,-0.975; 15 2.9,-0.325; 16 2.9,0.325; 17 2.9,0.975; 18 2.9,1.625; 19 2.9,2.275; 20 2.9,2.925
TI-DCU8 = smd 0.3 x 0.8: 1 -0.75,-1.55; 2 -0.25,-1.55; 3 0.25,-1.55; 4 0.75,-1.55; 5 0.75,1.55; 6 0.25,1.55; 7 -0.25,1.55; 8 -0.75,1.55
TI-DCT8 = smd 0.3 x 1.6: 1 -0.975,-1.7; 2 -0.325,-1.7; 3 0.325,-1.7; 4 0.975,-1.7; 5 0.975,1.7; 6 0.325,1.7; 7 -0.325,1.7; 8 -0.975,1.7
MC-ST8 = smd 1.45 x 0.45: 1 -2.95,0.975; 2 -2.95,0.325; 3 -2.95,-0.325; 4 -2.95,-0.975; 5 2.95,-0.975; 6 2.95,-0.325; 7 2.95,0.325; 8 2.95,0.975
TI-SOT23 = smd 0.6 x 1.05: 1 -0.95,-1.35; 2 0,-1.35; 3 0.95,-1.35; 4 0.95,1.35; 5 -0.95,1.35
ID-TSSOP8 = smd 0.4 x 1.5: 1 -0.975,-2.9; 2 -0.325,-2.9; 3 0.325,-2.9; 4 0.975,-2.9; 5 0.975,2.9; 6 0.325,2.9; 7 -0.325,2.9; 8 -0.975,2.9
TI-SOT223 = smd 0.55 x 2.15: 1 -2.54,-3.1; 2 -1.27,-3.1; 3 0,-3.1; 4 1.27,-3.1; 5 2.54,-3.1 | smd 3.45 x 2.15: 6 0,3.1
KC2520Z = smd 1.05 x 0.95: 1 -0.925,-0.725; 2 0.925,-0.725; 3 0.925,0.725; 4 -0.925,0.725

### Placement (x,y rotation side)
C1  70.5,9.5 270 top
C2  66,11 0 top
C3  66,43.5 90 top
C4  67,62 0 top
C5  70,31.5 90 top
C6  63,62.5 180 top
C7  70,27.5 270 top
C8  63,18.5 90 top
C9  36.5,5.5 90 top
C10  28.5,6.5 270 top
C11  30.5,3.5 180 top
C12  37.5,73 180 top
C13  37,78.5 270 top
C14  84.5,71 180 top
C15  5,72 180 top
C16  94.5,81 0 top
C17  12.5,82 180 top
C18  65,39.5 0 top
C19  62.5,9.5 270 top
FID1  5,60.5 0 top
FID2  99,60.5 0 top
FID3  43.5,13.5 0 top
FID4  5,60.5 0 bottom
FID5  99,60.5 0 bottom
FID6  43.5,13.5 0 bottom
J2  75,56 270 bottom
J3  54.86,16 180 top
J4  32,68.5 0 top
J5  54.86,68.5 0 top
J6  32,16 180 top
J7  40.45,52.15 270 bottom
J8  92,76.5 0 top
J9  12,76.5 0 top
L1  61.5,18.5 270 top
L2  68,15.5 90 top
R1  69.5,60.5 0 top
R2  69.5,59 0 top
R3  69.5,57 0 top
R4  69.5,55 0 top
R5  65.5,48.5 90 top
R6  64,48.5 90 top
R7  64.5,57.5 0 top
R8  64.5,53.5 0 top
R9  65,38 0 top
R10  61,59 180 top
R11  61,61 180 top
R12  61,55 180 top
R13  61,57 180 top
R14  60,40 180 top
R15  60,38.5 180 top
R16  30,5.5 270 top
R17  30,8 90 top
R24  33.5,73 90 top
R25  38.5,75.5 270 top
R38  83,67.5 0 top
R39  20,70 180 top
R44  100,71 0 top
R45  25,78 180 top
R46  100,69.5 0 top
R47  25,80.5 180 top
S1  74.5,24.5 90 top
S2  74.5,13.5 90 top
TP1  98.5,67.5 0 top
TP2  100,66.5 0 top
TP3  21,72.5 0 top
TP4  22.5,72.5 0 top
TP5  70,52 0 top
TP6  70,50 0 top
TP7  68,51 0 top
TP8  68,49 0 top
TP9  53.5,43.5 0 top
TP10  53.5,41.5 0 top
TP11  33.5,42.5 0 top
TP12  33.5,40.5 0 top
TP13  52,42.5 0 top
TP14  52,40.5 0 top
TP15  35,43.5 0 top
TP16  98.5,65.5 0 top
TP17  86.5,69 0 top
TP18  24,72.5 0 top
TP19  6.5,70 0 top
TP20  35,41.5 0 top
TP21  77,40 0 top
U2  65,66.5 180 top
U3  65.5,29.5 270 top
U4  65,59.5 90 top
U5  65,55.5 90 top
U6  63,43 180 top
U7  65.5,17.5 90 top
U8  33,6 90 top
U9  34.5,78.5 0 top
U10  66.5,5.5 180 top
U$1  [96BOARDS_FORM_FACTOR]  25,85 270 top
U$2  [FD5640-500W]  12,77 180 top
U$3  [FD5640-500W]  92,77 180 top
U$4  [MIKROBUS_LOGO1]  43,63.5 0 top
U$5  [MIKROBUS_LOGO2]  43.5,58 0 top
U$6  [MIKROBUS_LOGO2]  43.5,27 180 top
U$7  [MIKROBUS_LOGO1]  44,21 180 top
Y1  41,75 90 top

### Tracks (layer width: path | path; a pad name or v marks a point on that pad's centre or on a via)
+1.8V  (via drill 0.25, 0.35)
  Top 0.15: v70,58 R3.2 R4.2 | v70,58 R2.2 R1.2 | U4.2 67.25,59.25 67.5,59 67.5,58.5 68,58 v70,58 | U5.2 67.25,55.25 67.5,55 v67.5,54 | R6.2 R5.2 v66.5,49
  Top 0.3: U2.2 v66.35,64.22 C4.1 | U3.2 67.78,30.85 | 67.78,30.85 C5.1 v70,30 | U6.2 63.33,43.17 63.65,42.85 C3.1 v66,42 | J8.11 92.75,80.75 93,81 C16.1 v93.85,82 | U9.6 34.83,79.15 | R46.2 R44.2 v101.5,71 | U9.2 34.17,78.67 34.65,79.15 34.83,79.15 | v37,80.5 C13.1 34.83,79.15 | U3.10 62.58,31.43 63.15,30.85 67.78,30.85 | U2.10 v66.5,69.42 | J9.11 12.75,80.25 13.15,80.65 C17.1 v23.5,82 23.5,81 24,80.5 R47.2 | R45.2 v23.5,78 | Y1.4 38.58,74.08 38.15,73.65 C12.1 v39,73
  Route2 0.3: 32.5,84.5 23.5,84.5 v23.5,82 v23.5,78 v23.5,76.5 | 32.5,84.5 70,84.5 v70,82 | 32.5,84.5 32.5,80.5 v37,80.5 38,80.5 38,73.5 38.5,73 v39,73 | v70,82 v71,82 v71,80 | v71,80 v70,80 v70,81 v70,82 | v71,81 v71,80
  Route3 0.15: 73,64.22 73,64
  Route3 0.3: 73,42 73,41 | 73,42 73,50 | 73,50 73,54 | 73,54 73,58 | 73,58 73,64 73,70 | v70,58 73,58 | v70,30 68.5,30 68.5,41 70,41 | v66.35,64.22 73,64.22 | v67.5,54 73,54 | v66,42 73,42 | v66.5,49 66.5,50 73,50 | v66.5,69.42 66.5,70 73,70 | v93.85,82 93.85,83.5 | v101.5,71 102.5,71 102.5,83 102,83.5 93.85,83.5 | v70,41.5 70,41 | v70,40.5 70,41 | v71,41.5 71,41 | v71,40.5 71,41 | v75,41.5 75,41 | 75,41 v75,40.5 | 70,41 71,41 | 71,41 73,41 | 73,41 75,41 | v71,82 v71,80 | v71,80 73,80 73,78.5 | 73,78.5 73,70 | 93.85,83.5 78,83.5 78,78.5 73,78.5 | v71,80 v70,80
  Bottom 0.3: 75,41 J2.35 71,41 | 75,41 v75,40.5 | 75,41 v75,41.5 | v70,41.5 70,41 | 70,41 v70,40.5 | v71,41.5 71,41 | v71,40.5 71,41 | 70,41 71,41
  pour Route3 (isolate 0.254, rank 2, no thermals): 75.5,40 69.5,40 69.5,38 71,38 71,29.5 66,29.5 66,71.5 72,71.5 72,79 69.5,79 69.5,85 104,85 104,70 101,70 101,77.5 75.5,77.5
  pour Bottom (no thermals): 69.5,42 69.5,40 75.5,40 75.5,42
  pour Route2 (no thermals): 23.5,85 23.5,75 45.5,75 45.5,77.5 47,79 73,79 73,85
+2.8V_LDO  (via drill 0.25, 0.35)
  Top 0.15: 30,5.05 R16.2
  Top 0.3: U8.5 31.65,3.65 31.5,3.5 C11.1 | J9.4 v16.25,78 | J8.4 v96.25,78.05
  Top 0.5: U8.5 30,5.05 | R16.2 29,5 28.5,5.5 C10.2 v27,5.85
  Route2 1: v16.25,78 16.25,76.75 16,76.5 15,76.5 14.5,76 14.5,56.5 15,56 26.5,56 27,55.5 v27,9.5
  Route3 1: v27,5.85 v27,9.5 60.5,9.5 61,9 61,2 62,1 71,1 71.85,1.85 71.85,5.85 73.15,7.15 77.15,7.15 78,8 78,73 79,74 95.5,74 96.25,74.75 v96.25,78.05
  pour Route3: 26,9.5 26,4 30.5,4 30.5,3 32.5,3 32.5,6 29.5,6 29.5,9.5
+3.3V  (via drill 0.25, 0.3, 0.35)
  Top 0.15: C2.1 65.23,11 | R9.2 v66,38
  Top 0.3: U2.19 63.27,64.22 63.65,63.85 C6.1 v64.5,62.5 | U3.19 67.78,27.77 68.15,28.15 C7.1 v70,29 | 65.23,11 U10.4 | C15.1 6.5,72 6.75,72.25 v6.75,78 J9.23 | J8.23 v86.75,78 | C2.1 v65.35,12 | R15.2 R14.2 v58,40 | R10.2 R13.2 60.5,58 v61,58 | R11.2 60.5,61.69 v60.98,61.69 | R12.2 60.5,54.5 v61,54 | R7.2 v66,57.5 | R8.2 v66,53.5 | L1.2 v61.5,17 | J4.7 v32,53.26 | J3.7 v53.21,30.5
  Top 0.5: v86,71 C14.1
  Route2 0.3: v6.75,78 15,78 15,79 21.5,79 21.5,71 32,71 | 32,71 63.5,71 v63.5,71.75 v64.5,71.75 | v32,53.26 32,71 | v64.5,71.75 v65.5,71.75 65.5,71 | v63.5,70.75 v64.5,70.75 | v64.5,70.75 v65.5,70.75 | v64.5,71.75 v64.5,70.75
  Route2 0.5: v86,71 65.5,71
  Route3 0.15: v66,38 65.35,38
  Route3 0.3: v65.35,12 65.35,17 | 65.35,17 65.35,29 | 65.35,29 65.35,30.5 | 65.35,30.5 65.35,38 65.35,40 | 65.35,40 65.35,45.45 64.5,45.45 64.5,53.5 | v58,40 65.35,40 | v61,58 64.5,58 | v60.98,61.69 64.5,61.69 | v66,57.5 64.5,57.5 | v66,53.5 64.5,53.5 | v70,29 65.35,29 | v61.5,17 65.35,17 | 64.5,53.5 64.5,54 | 64.5,54 64.5,57.5 | 64.5,57.5 64.5,58 | v61,54 64.5,54 | 64.5,61.69 64.5,58 | 64.5,61.69 v64.5,62.5 v64.5,70.75 v64.5,71.75 | v53.21,30.5 65.35,30.5
  Bottom 0.3: v86.75,78 86.75,71.75 v86,71
  pour Route3 (isolate 0.254, no thermals): 65,11.5 70.5,11.5 70.5,29.5 66,29.5 66,72 61.5,72 61.5,51.5 53.5,51.5 53.5,13 65,13
  pour Route2 (isolate 0.254, no thermals): 22,80 5.5,80 5.5,77.5 19,77.5 19,69 30,69 30,51.5 35,51.5 35,67.5 67,67.5 67,72.5 41.5,72.5 41.5,71.5 35,71.5 35,72.5 22,72.5
+5.0V  (via drill 0.35)
  Top 0.15: C9.1 36.5,5.05
  Top 0.3: 36.5,5.05 U8.1 33.5,5.05 33,5.55 33,6.5 33.45,6.95 U8.3 v34.35,11.5 | C1.1 69.65,10.15 69.04,9.54 U10.1 U10.2 v67.77,10 | J6.10 30.5,31.09 v30.5,30.24 | v54.25,53.26 J5.10
  Route3 0.3: v34.35,11.5 51,11.5 | 51,11.5 63.5,11.5 63.5,9 67.77,9 | 67.77,9 72,9 72,39 | v67.77,10 67.77,9 | 51,30.24 51,53.26 v54.25,53.26 | 51,30.24 v30.5,30.24 | v70,39.5 70,39 | 70,39 v70,38.5 | v71,39.5 71,39 | v71,38.5 71,39 | v75,39.5 75,39 | 75,39 v75,38.5 | 70,39 71,39 | 71,39 72,39 | 72,39 75,39 | 51,30.24 51,11.5
  Bottom 0.3: 75,39 J2.37 71,39 | 75,39 v75,38.5 | v75,39.5 75,39 | v70,39.5 70,39 | 70,39 v70,38.5 | 70,39 71,39 | v71,39.5 71,39 | 71,39 v71,38.5
  pour Route3 (isolate 0.254, no thermals): 69.5,40 69.5,38 71,38 71,11 64.5,11 64.5,12.5 53,12.5 53,52 58,52 58,54.5 50.5,54.5 50.5,31 30,31 30,29 50.5,29 50.5,10.5 62,10.5 62,8 73.5,8 73.5,38 75.5,38 75.5,40
  pour Route3 (isolate 0.254, no thermals): 50.5,10.5 33.5,10.5 33.5,12.5 50.5,12.5
  pour Bottom (rank 2, no thermals): 69.5,40 75.5,40 75.5,38 69.5,38
AGND
  Top 0.15: 66.47,14.85 U7.4
  Top 0.3: L2.1 66.47,14.85 66.47,17.5 66.12,17.85 C8.1
CH1_XCLK  (via drill 0.25)
  Top 0.15: J8.13 v91.75,78 | v84.5,67.5 R38.2
  Bottom 0.15: v91.75,78 91.75,68.25 91,67.5 v84.5,67.5
CH2_XCLK
  Top 0.15: R39.2 12,70 11.75,70.25 J9.13
CLK0  (via drill 0.25)
  Top 0.15: R24.1 33.5,70.5 34,70 v36.5,70
  Bottom 0.15: J7.15 36.85,58.15 36.5,58.5 v36.5,70
CSI0_C_N  (via drill 0.25)
  Top 0.32: J8.18 89.25,80.34 89.5,80.59 89.5,82.5 89,83 80,83 79.5,82.5 79.5,77.79 78.85,77.15 78.71,77 78.62,76.91 68.59,76.91 v68.5,76.82
  Bottom 0.32: J7.4 44.16,62.95 45.5,64.29 45.5,76.5 48,79 48,82.5 48.5,83 59.37,83 arc-90 59.76,82.61 59.76,78.2 arc90 60.64,77.32 60.83,77.32 arc90 61.71,78.2 61.71,82.61 arc-90 62.1,83 62.28,83 arc-90 62.66,82.61 62.66,78.2 arc90 63.55,77.32 63.73,77.32 arc90 64.61,78.2 64.61,82.61 arc-90 65,83 65.5,83 66,82.5 66,77.79 66.97,76.82 v68.5,76.82
CSI0_C_P  (via drill 0.25)
  Top 0.32: J8.16 90.25,80.34 90,80.59 90,82.71 89.21,83.5 79.79,83.5 79,82.71 79,78 78.41,77.41 68.59,77.41 v68.5,77.5
  Bottom 0.32: J7.2 44.25,63.75 45,64.5 45,76.71 47.5,79.21 47.5,82.71 48.29,83.5 59.37,83.5 arc-90 60.26,82.61 60.26,78.2 arc90 60.64,77.82 60.83,77.82 arc90 61.21,78.2 61.21,82.61 arc-90 62.1,83.5 62.28,83.5 arc-90 63.16,82.61 63.16,78.52 arc90 63.55,78.13 63.73,78.13 arc90 64.11,78.52 64.11,82.61 arc-90 65,83.5 65.71,83.5 66.5,82.71 66.5,78 67,77.5 v68.5,77.5
CSI0_D0_N  (via drill 0.25)
  Top 0.32: J8.22 87.25,79.83 87.46,80.04 87.5,80.04 87.5,80.65 87.15,81 82,81 81.5,80.5 81.5,75.79 80.71,75 67.59,75 v67.5,74.91
  Bottom 0.32: J7.10 44.29,60.55 44.44,60.7 46.91,60.7 47.5,61.29 47.5,74.5 48,75 49.2,75 arc90 50.08,75.89 50.08,80.75 arc-90 50.47,81.14 50.8,81.14 arc-90 51.19,80.75 51.19,75.89 arc90 52.07,75 52.41,75 arc90 53.3,75.89 53.3,80.75 arc-90 53.68,81.14 54.02,81.14 arc-90 54.4,80.75 54.4,75.89 arc90 55.29,75 55.62,75 arc90 56.51,75.89 56.51,80.75 arc-90 56.89,81.14 57.23,81.14 arc-90 57.62,80.75 57.62,75.89 arc90 58.5,75 67.41,75 v67.5,74.91
CSI0_D0_P  (via drill 0.25)
  Top 0.32: J8.20 88.25,79.83 88.04,80.04 88,80.04 88,80.85 87.35,81.5 81.79,81.5 81,80.71 81,76 80.5,75.5 67.59,75.5 v67.5,75.59
  Bottom 0.32: J7.8 44.29,61.35 44.44,61.2 46.7,61.2 47,61.5 47,74.71 47.79,75.5 49.2,75.5 arc90 49.58,75.89 49.58,80.75 arc-90 50.47,81.64 50.8,81.64 arc-90 51.69,80.75 51.69,76.3 arc90 52.07,75.91 52.41,75.91 arc90 52.8,76.3 52.8,80.75 arc-90 53.68,81.64 54.02,81.64 arc-90 54.9,80.75 54.9,75.89 arc90 55.29,75.5 55.62,75.5 arc90 56.01,75.89 56.01,80.75 arc-90 56.89,81.64 57.23,81.64 arc-90 58.12,80.75 58.12,75.89 arc90 58.5,75.5 67.41,75.5 v67.5,75.59
CSI0_D1_N  (via drill 0.25)
  Top 0.32: v68.5,72.91 68.59,73 87.5,73 88.15,72.35 101.06,72.35 102.5,73.79 102.5,82.71 101.71,83.5 92.29,83.5 91.5,82.71 91.5,80.59 91.25,80.34 J8.14
  Bottom 0.32: J7.16 44.29,58.15 44.44,58.3 49.01,58.3 49.5,58.79 49.5,72.5 50,73 68.41,73 v68.5,72.91
CSI0_D1_P  (via drill 0.25)
  Top 0.32: v68.5,73.59 68.59,73.5 87.71,73.5 88.35,72.85 89.43,72.85 arc90 89.82,73.24 89.82,73.42 arc-90 90.2,73.81 92.7,73.81 arc-90 93.08,73.42 93.08,73.24 arc90 93.47,72.85 95.97,72.85 arc90 96.35,73.24 96.35,73.42 arc-90 96.73,73.81 99.23,73.81 arc-90 99.61,73.42 99.61,73.24 arc90 100,72.85 100.85,72.85 102,74 102,82.5 101.5,83 92.5,83 92,82.5 92,80.59 92.25,80.34 J8.12
  Bottom 0.32: J7.14 44.29,58.95 44.44,58.8 48.8,58.8 49,59 49,72.71 49.79,73.5 68.41,73.5 v68.5,73.59
CSI1_C_N  (via drill 0.25)
  Top 0.32: J9.18 9.25,80.34 v9.41,80.5
  Bottom 0.32: J7.56 44.29,42.15 44.44,42.3 44.7,42.3 45,42 45,37.5 44.5,37 31.5,37 31,37.5 31,61.55 arc90 30.11,62.43 27.89,62.43 arc-90 27.51,62.82 27.51,63.02 arc-90 27.89,63.4 30.11,63.4 arc90 31,64.29 31,64.49 arc90 30.11,65.37 27.89,65.37 arc-90 27.51,65.76 27.51,65.96 arc-90 27.89,66.34 30.11,66.34 arc90 31,67.23 31,67.43 arc90 30.11,68.32 27.89,68.32 arc-90 27.51,68.7 27.51,68.9 arc-90 27.89,69.29 30.11,69.29 arc90 31,70.17 31,70.37 arc90 30.11,71.26 27.89,71.26 arc-90 27.51,71.64 27.51,71.84 arc-90 27.89,72.23 30.11,72.23 arc90 31,73.11 31,73.32 arc90 30.11,74.2 27.89,74.2 arc-90 27.51,74.59 27.51,74.79 arc-90 27.89,75.17 30.11,75.17 arc90 31,76.06 31,76.26 arc90 30.11,77.14 27.89,77.14 arc-90 27.51,77.53 27.51,77.73 arc-90 27.89,78.11 30.11,78.11 arc90 31,79 31,80.3 | v9.41,80.5 9.5,80.59 9.5,82.71 10.29,83.5 30.21,83.5 31,82.71 31,81.2 | 31,80.3 | 31,80.3 31,81.2 | 31,81.2
CSI1_C_P  (via drill 0.25)
  Top 0.32: J9.16 10.25,80.34 v10.09,80.5
  Bottom 0.32: J7.54 44.29,42.95 44.44,42.8 44.91,42.8 45.5,42.21 45.5,37.29 44.71,36.5 31.29,36.5 30.5,37.29 30.5,61.55 arc90 30.11,61.93 27.89,61.93 arc-90 27.01,62.82 27.01,63.02 arc-90 27.89,63.9 29.7,63.9 arc90 30.09,64.29 30.09,64.49 arc90 29.7,64.87 27.89,64.87 arc-90 27.01,65.76 27.01,65.96 arc-90 27.89,66.84 30.11,66.84 arc90 30.5,67.23 30.5,67.43 arc90 30.11,67.82 27.89,67.82 arc-90 27.01,68.7 27.01,68.9 arc-90 27.89,69.79 30.11,69.79 arc90 30.5,70.17 30.5,70.37 arc90 30.11,70.76 27.89,70.76 arc-90 27.01,71.64 27.01,71.84 arc-90 27.89,72.73 30.11,72.73 arc90 30.5,73.11 30.5,73.32 arc90 30.11,73.7 27.89,73.7 arc-90 27.01,74.59 27.01,74.79 arc-90 27.89,75.67 30.11,75.67 arc90 30.5,76.06 30.5,76.26 arc90 30.11,76.64 27.89,76.64 arc-90 27.01,77.53 27.01,77.73 arc-90 27.89,78.61 30.11,78.61 arc90 30.5,79 | 30.5,82.5 30,83 10.5,83 10,82.5 10,80.59 v10.09,80.5 | 30.5,79 | 30.5,79 30.5,82.5 | 30.5,82.5
CSI1_D0_N  (via drill 0.25)
  Top 0.32: J9.22 7.25,80.34 v7.41,80.5
  Bottom 0.32: v7.41,80.5 7.5,80.59 7.5,81.5 7,82 2.5,82 2,81.5 2,80.2 | 2,57.8 2,56.5 2.5,56 26.21,56 27,55.21 27,33 27.5,32.5 35.36,32.5 arc90 35.75,32.88 35.75,32.96 arc-90 36.13,33.35 38.48,33.35 arc-90 38.87,32.96 38.87,32.88 arc90 39.25,32.5 41.61,32.5 arc90 41.99,32.88 41.99,32.96 arc-90 42.38,33.35 44.73,33.35 arc-90 45.12,32.96 45.12,32.88 arc90 45.5,32.5 48.5,32.5 49,33 49,46.5 48.4,47.1 44.44,47.1 44.29,46.95 J7.44 | 2,57.8 | 2,80.2 2,69.88 arc90 2.38,69.5 2.46,69.5 arc-90 2.85,69.11 2.85,68.01 arc-90 2.46,67.63 2.38,67.63 arc90 2,67.24 2,66.14 arc90 2.38,65.76 2.46,65.76 arc-90 2.85,65.37 2.85,64.27 arc-90 2.46,63.88 2.38,63.88 arc90 2,63.5 2,57.8 | 2,80.2
CSI1_D0_P  (via drill 0.25)
  Top 0.32: J9.20 8.25,80.34 v8.09,80.5
  Bottom 0.32: v8.09,80.5 8,80.59 8,81.71 7.21,82.5 2.29,82.5 1.5,81.71 1.5,56.29 2.29,55.5 26,55.5 26.5,55 26.5,32.79 27.29,32 48.71,32 49.5,32.79 49.5,46.71 48.61,47.6 44.44,47.6 44.29,47.75 J7.42
CSI1_D1_N  (via drill 0.25)
  Top 0.32: J9.14 11.25,80.34 v11.41,80.5
  Bottom 0.32: v11.41,80.5 11.5,80.59 11.5,80.74 11.85,81.09 11.97,81.09 12.38,81.5 21.21,81.5 22,80.71 22,79.2 | J7.50 44.29,44.55 44.44,44.7 46.3,44.7 47,44 47,35.5 46.5,35 29.5,35 29,35.5 29,59.21 28.21,60 22.5,60 22,60.5 22,61.8 | 22,79.2 | 22,61.8 22,62.02 arc90 21.11,62.91 19.79,62.91 arc-90 19.41,63.29 19.41,63.34 arc-90 19.79,63.72 23.71,63.72 arc90 24.59,64.61 24.59,64.65 arc90 23.71,65.54 19.79,65.54 arc-90 19.41,65.92 19.41,65.97 arc-90 19.79,66.35 23.71,66.35 arc90 24.59,67.24 24.59,67.28 arc90 23.71,68.17 19.79,68.17 arc-90 19.41,68.55 19.41,68.6 arc-90 19.79,68.98 23.71,68.98 arc90 24.59,69.87 24.59,69.91 arc90 23.71,70.8 19.79,70.8 arc-90 19.41,71.18 19.41,71.23 arc-90 19.79,71.61 21.11,71.61 arc90 22,72.5 22,79.2 | 22,61.8
CSI1_D1_P  (via drill 0.25)
  Top 0.32: J9.12 12.25,80.34 v12.09,80.5
  Bottom 0.32: 21.5,80.5 21,81 12.59,81 v12.09,80.5 | J7.48 44.29,45.35 44.44,45.2 46.51,45.2 47.5,44.21 47.5,35.29 46.71,34.5 29.29,34.5 28.5,35.29 28.5,59 28,59.5 22.29,59.5 21.5,60.29 21.5,62.02 arc90 21.11,62.41 19.79,62.41 arc-90 18.91,63.29 18.91,63.34 arc-90 19.79,64.22 23.37,64.22 arc90 23.75,64.61 23.75,64.65 arc90 23.37,65.04 19.79,65.04 arc-90 18.91,65.92 18.91,65.97 arc-90 19.79,66.85 23.71,66.85 arc90 24.09,67.24 24.09,67.28 arc90 23.71,67.67 19.79,67.67 arc-90 18.91,68.55 18.91,68.6 arc-90 19.79,69.48 23.71,69.48 arc90 24.09,69.87 24.09,69.91 arc90 23.71,70.3 19.79,70.3 arc-90 18.91,71.18 18.91,71.23 arc-90 19.79,72.11 21.11,72.11 arc90 21.5,72.5 21.5,80.5 | 21.5,80.5
GND  (via drill 0.25, 0.3, 0.35, 1.5, 2.5 pad 5, 2.6 pad 5)
  Top 0.15: 36.5,6 C9.2 | C2.2 66.5,11 | J8.FG@1 84,76.5 | J8.FG@2 100,76.5 | U2.11 61,69.42 v61,69.5 | U5.1 66.55,54 v66.5,54 | v68.5,62 C4.2 | C6.2 v61.5,62.5
  Top 0.3: U8.2 36.5,6 | 66.5,5.5 U10.3 66.5,11 | U10.6 66.5,5.5 | C19.2 62.5,5.5 66.5,5.5 | 66.5,5.5 70.5,5.5 C1.2 | 84,76.5 v84,77.5 | 100,76.5 v100,77.5 | C13.2 v37,76.6 37,75.6 U9.4 | C5.2 v70,33 | J8.15 v90.75,78 | C12.2 v35.85,73 | Y1.2 v43,75.92 | C17.2 v11,82 | C16.2 v95.15,82 | C14.2 v83.85,70 | L2.2 v68,17 | C7.2 v70,26 | C3.2 v66,45 | J4.8 v32,50.72 | J5.9 54,50.72 v54,51.5 | v3.95,77.5 J9.FG@1 v3.95,75.5 | C15.2 v3.5,72 | R17.2 v31,8.5 | v20.05,75.5 J9.FG@2 v20.05,77.5 | J8.FG@1 v83.95,75.5 | J8.FG@2 v100.05,75.5 | J6.9 v32,33.78 | v76,8.5 S2.3 S2.4 S1.3 S1.4 v76,29.5 | U10.6 v69,2.4 | U10.6 v64,2.4 | v64.5,6.4 v64.5,4.4 | v68.5,6.4 v68.5,4.4 | C9.2 v36.5,7 | C11.2 v29,3.5 | C2.2 v66.65,12 | J3.8 v56.51,33
  Bottom 0.3: J7.24 40.5,54.95 | J7.58 40.5,41.35 40.5,42.15 | 40.5,54.95 40.5,54.15 | 40.5,52.55 40.5,49.35 | 40.5,49.35 40.5,48.55 | 40.5,46.95 40.5,46.15 | 40.5,46.15 40.5,43.75 | 40.5,43.75 40.5,42.15 | J7.55 40.5,42.15 | J7.52 40.5,43.75 | J7.46 40.5,46.15 | J7.40 40.5,48.55 | J7.43 40.5,46.95 | 40.5,46.95 40.5,48.55 | J7.37 40.5,49.35 | J7.30 40.5,52.55 | 40.5,52.55 40.5,54.15 | J7.25 40.5,54.15 | J7.19 40.5,56.55 | 40.5,56.55 40.5,54.95 | J7.18 40.5,57.35 | 40.5,57.35 40.5,56.55 | J7.12 40.5,59.75 | 40.5,59.75 40.5,58.95 | J7.13 40.5,58.95 | 40.5,58.95 40.5,57.35 | J7.6 40.5,62.15 40.5,59.75 | J2.39 75,37 | J2.40 76.5,37 | 76.5,37 75,37 | 75,37 v75,37.5 | 75,37 v75,36.5 | v76.5,35.5 v74.5,35.5 v74.5,33.5 v76.5,33.5 v76.5,34.5 | v76.5,35.5 v76.5,34.5 | v76.5,34.5 v75.5,34.5 | v76.5,35.5 76.5,37 | J2.2 J2.1
  other vias: 66.5,4.4 66.5,6.4 74.5,34.5 75.5,35.5 75.5,33.5 43.5,81 75,81 75,4 102,56 83.5,64 83.5,57 90.75,84.25 103,84 1,55 25.5,54.5 25.75,31.5 26.25,1.25 1.25,83.75 28.5,81 5.5,66 16,66 25.5,61.5 27,58 28,34 30,36 46,43.5 48,34 46,36 40.5,42 40.5,49.5 40.5,65 40.5,60 40.5,55 48,46.25 32.25,38.25 8.5,84 46,62.25 46,59.75 46,57.25 46.5,76 50.5,74.5 64.25,74.25 68,81 80,76.5 80.5,82 88.5,82 43.5,27.75 59.75,8.25 47.5,15.75 77.75,1.25 75,74.25 75,76.25 71,76.25 71,74.25 70.5,72.25 97,70 80,72 68,81.75 59.25,76.5 57,74.5 58,71.75 51,71.75 26,67.75 25.5,74 5.5,58 64.5,76.5
  pour Top (isolate 0.254, rank 5, no thermals): 0,85 0,54 23.29,54 arc-90 25,52.29 25,0 79,0 79,52.29 arc-90 80.71,54 104,54 104,85
  pour Bottom (rank 5, no thermals): 0,85 0,54 23.29,54 arc-90 25,52.29 25,0 79,0 79,52.29 arc-90 80.71,54 104,54 104,85
  pour Route2 (isolate 0.254, rank 5, no thermals): 0,85 0,54 19.5,54 23.29,54 arc-90 25,52.29 25,32.5 25,0 39,0 79,0 79,10.5 79,52.29 arc-90 80.71,54 92,54 104,54 104,69 104,85 89,85
  pour Route3 (isolate 0.254, rank 5, no thermals): 0,85 0,54 20,54 23.29,54 arc-90 25,52.29 25,32 25,0 42.5,0 79,0 79,10.5 79,52.29 arc-90 80.71,54 91.5,54 104,54 104,72 104,85 86,85
I2C0_SCL  (via drill 0.25)
  Top 0.15: U4.3 65.75,59.75 65.5,60 65.5,60.75 65.75,61 v68,61 68.5,60.5 R1.1
  Bottom 0.15: J2.15 v68,61
I2C0_SDA  (via drill 0.25)
  Top 0.15: U4.4 67.75,60.25 68,60 v68,59 R2.1
  Bottom 0.15: J2.17 v68,59
I2C1_SCL  (via drill 0.25)
  Top 0.15: U5.3 65.75,55.75 65.5,56 65.5,56.75 65.75,57 v68,57 R3.1
  Bottom 0.15: J2.19 v68,57
I2C1_SDA  (via drill 0.25)
  Top 0.15: U5.4 67.75,56.25 68,56 v68,55 R4.1
  Bottom 0.15: J2.21 v68,55
I2C2_SCL  (via drill 0.25)
  Top 0.15: v48,51.75 48,83.5 48.5,84 v71.95,84 | v99,69.5 R46.1 | J8.5 95.75,80.25 96,80.5 v99,80.5
  Bottom 0.15: v48,51.75 J7.32 | v99,69.5 v99,80.5 99,83 98.5,83.5 79,83.5 78,84.5 72.45,84.5 v71.95,84
I2C2_SDA  (via drill 0.25)
  Top 0.15: v48.5,50.95 48.5,83 49,83.5 v72.5,83.5 | R44.1 v98.5,71 | J8.3 96.75,79.75 97,80 v98.5,80
  Bottom 0.15: J7.34 v48.5,50.95 | v72.5,83.5 73,84 77.5,84 78.5,83 98,83 98.5,82.5 v98.5,80 v98.5,71
I2C3_SCL  (via drill 0.25)
  Top 0.15: v47.5,50.15 47.5,77.5 47,78 41,78 40.5,78.5 40.5,82.5 40,83 27,83 26.5,82.5 26.5,80 26,79.5 25.5,79.5 | 25.5,79.5 23.5,79.5 22,81 16,81 15.75,80.75 J9.5 | R47.1 25.5,79.5
  Bottom 0.15: J7.36 v47.5,50.15
I2C3_SDA  (via drill 0.25)
  Top 0.15: J9.3 16.75,80.25 17,80.5 21.5,80.5 23,79 25.5,79 | v47,49.35 47,77 46.5,77.5 40.5,77.5 40,78 40,82 39.5,82.5 27.5,82.5 27,82 27,79.5 26.5,79 25.5,79 | R45.1 25.5,79
  Bottom 0.15: J7.38 v47,49.35
INT1  (via drill 0.25)
  Top 0.15: U3.5 65.83,33.83 66.5,34.5 72.5,34.5 73,35 73,43.5 73.5,44 v75,44
  Bottom 0.15: J2.33 74.5,43 75,43.5 v75,44
INT2  (via drill 0.25)
  Top 0.15: U3.4 66.47,33.48 67,34 73,34 73.5,34.5 73.5,43 74,43.5 76.5,43.5 v77,44
  Bottom 0.15: J2.34 77,43.05 v77,44
MB1_AN
  Top 0.15: J3.1 64.5,16 65.17,15.32 U7.2
MB1_INT  (via drill 0.25)
  Top 0.15: J5.15 51.46,65.96 51,65.5 51,49.5 51.5,49 v61,49 | v61,23.5 65.5,23.5 65.83,23.82 U3.16
  Bottom 0.15: v61,49 v61,23.5
MB1_PWM  (via drill 0.25)
  Top 0.15: v58,48.5 51,48.5 50.5,49 50.5,68 51,68.5 J5.16 | U6.5 62.02,41 v58,41 60.5,41 R14.1
  Bottom 0.15: v58,48.5 v58,41
MB1_RST  (via drill 0.25)
  Top 0.15: U3.14 64.53,25.02 64,24.5 v54,24.5 | J3.2 v54,18.54
  Bottom 0.15: v54,18.54 v54,24.5
MB1_RX  (via drill 0.25)
  Top 0.15: J5.14 v51.5,63.42 | v51.5,69.5 58,69.5 58.5,69 58.5,68.5 58.88,68.12 U2.13
  Bottom 0.15: v51.5,69.5 v51.5,63.42
MB1_SCL
  Top 0.15: J5.12 58.84,58.34 59,58.5 59,59.5 59.25,59.75 61.5,59.75 | U4.6 61.5,59.75 | R10.1 61.5,59.75
MB1_SDA  (via drill 0.25)
  Top 0.15: J5.11 v56,55.8 | U4.5 61.5,60.25 | 61.5,60.25 v56,60.25 | R11.1 61.5,60.25
  Bottom 0.15: v56,60.25 v56,55.8
MB1_TX  (via drill 0.25)
  Top 0.15: v52,60.88 J5.13 | U2.12 59.23,68.78 59,69 59,69.5 58.5,70 v52,70
  Bottom 0.15: v52,70 v52,60.88
MB2_AN  (via drill 0.25)
  Top 0.15: J4.1 38.5,68.5 39,68 39,48.5 39.5,48 v59,48 | v59,13.5 65.5,13.5 65.83,13.82 U7.3
  Bottom 0.15: v59,48 v59,13.5
MB2_INT  (via drill 0.25)
  Top 0.15: J6.15 38.04,18.54 38.5,19 38.5,32.5 39,33 v54.5,33 | U3.17 66.47,23.48 66,23 58,23 57.5,22.5 v54.5,22.5
  Bottom 0.15: v54.5,22.5 v54.5,33
MB2_PWM  (via drill 0.25)
  Top 0.15: J6.16 38.5,16 39,16.5 39,32 39.5,32.5 v53.5,32.5 | v53.5,37.5 60.5,37.5 | 60.5,37.5 62,37.5 62.67,38.17 U6.6 | R15.1 60.5,37.5
  Bottom 0.15: v53.5,32.5 v53.5,37.5
MB2_RST  (via drill 0.25)
  Top 0.15: J4.2 38.04,65.96 38.5,65.5 38.5,48 39,47.5 v61.5,47.5 | v61.5,24 64.5,24 65.17,24.68 U3.15
  Bottom 0.15: v61.5,47.5 v61.5,24
MB2_RX  (via drill 0.25)
  Top 0.15: J6.14 37.5,21.08 38,21.58 38,34 38.5,34.5 47,34.5 47.5,35 v55.5,35 | U2.18 v55.5,64.88
  Bottom 0.15: v55.5,64.88 v55.5,35
MB2_SCL  (via drill 0.25)
  Top 0.15: J6.12 36.66,26.16 37,26.5 37,36.5 37.5,37 v57,37 | U5.6 61.5,55.75 | 61.5,55.75 v57,55.75 | R12.1 61.5,55.75
  Bottom 0.15: v57,55.75 v57,37
MB2_SDA  (via drill 0.25)
  Top 0.15: J6.11 36.2,28.7 36.5,29 36.5,38.5 37,39 v57.5,39 | U5.5 61.5,56.25 | 61.5,56.25 v57.5,56.25 | R13.1 61.5,56.25
  Bottom 0.15: v57.5,56.25 v57.5,39
MB2_TX  (via drill 0.25)
  Top 0.15: v60.5,35.5 47,35.5 46.5,35 38,35 37.5,34.5 37.5,24 37.12,23.62 J6.13 | U2.16 v60.5,66.17
  Bottom 0.15: v60.5,66.17 v60.5,35.5
N$1  (via drill 0.25)
  Top 0.15: J8.6 v95.25,77.5
  Bottom 0.15: v95.25,77.5 95.25,68.25 96,67.5 TP1.TP
  other vias: 98.5,67.5
N$2  (via drill 0.25)
  Top 0.15: J8.8 v94.25,77.5
  Bottom 0.15: v94.25,77.5 94.25,67.25 95,66.5 TP2.TP
  other vias: 100,66.5
N$3
  Top 0.15: TP3.TP 15.5,72.5 15.25,72.75 J9.6
N$4
  Top 0.15: TP4.TP 21.5,71.5 14.5,71.5 14.25,71.75 J9.8
N$5
  Top 0.15: U4.7 U4.8 63.45,58.05 R7.1
N$6
  Top 0.15: U6.7 U6.8 64.2,41.3 64.5,41 64.5,39.5 | C18.1 64.5,39.5 | 64.5,39.5 R9.1
N$7
  Top 0.15: U5.7 U5.8 63.45,54.05 R8.1
N$8
  Top 0.15: C19.1 63.35,10.15 63.96,9.54 U10.5
N$9
  Top 0.15: 30,6.95 R17.1 28.85,7.5 C10.1 | 30,6.95 R16.1 | U8.4 30,6.95
N$10  (via drill 0.25)
  Top 0.15: v70.5,53 70,52.5 TP5.TP
  Bottom 0.15: J2.23 v70.5,53
N$11  (via drill 0.25)
  Top 0.15: v73,31.5 S1.2 S1.1
  Bottom 0.15: v73,31.5 63,31.5 62.5,32 62.5,69.5 63,70 69.5,70 70.5,70 71,70.5 71,71.5 71.5,72 76.5,72 77.05,72.55 J2.4
N$12  (via drill 0.25)
  Top 0.15: v75,70 64,70 v63.5,69.5 | v73,19 S2.2 S2.1
  Bottom 0.15: J2.6 77.05,70.55 76.5,70 v75,70 | v73,19 73.5,19 74,19.5 74,31.5 73.5,32 63.5,32 63,32.5 63,69 v63.5,69.5
N$13  (via drill 0.25)
  Top 0.15: v70.5,49 70,49.5 TP6.TP
  Bottom 0.15: J2.27 v70.5,49
N$14  (via drill 0.25)
  Top 0.15: v68.5,52 68,51.5 TP7.TP
  Bottom 0.15: J2.24 77.05,52.55 76.5,52 v68.5,52
N$15  (via drill 0.25)
  Top 0.15: v70,48 68.5,48 68,48.5 TP8.TP
  Bottom 0.15: J2.28 77.05,48.55 76.5,48 v70,48
N$16  (via drill 0.25)
  Bottom 0.15: J7.21 34.25,55.75 33.5,55 TP11.TP
  other vias: 33.5,42.5
N$17  (via drill 0.25)
  Bottom 0.15: J7.23 34.45,54.95 34,54.5 34,41 TP12.TP
  other vias: 33.5,40.5
N$18  (via drill 0.25)
  Bottom 0.15: J7.27 35.35,53.35 35,53 TP15.TP
  other vias: 35,43.5
N$19  (via drill 0.25)
  Bottom 0.15: J7.29 36.05,52.55 35.5,52 35.5,42 TP20.TP
  other vias: 35,41.5
N$20  (via drill 0.25)
  Bottom 0.15: J7.20 52.45,56.55 53,56 53,44 TP9.TP
  other vias: 53.5,43.5
N$21  (via drill 0.25)
  Bottom 0.15: TP10.TP 53,41.5 52.5,42 52.5,55 51.75,55.75 J7.22
  other vias: 53.5,41.5
N$22  (via drill 0.25)
  Bottom 0.15: J7.26 51.35,54.15 52,53.5 TP13.TP
  other vias: 52,42.5
N$23  (via drill 0.25)
  Bottom 0.15: TP14.TP 51.5,41 51.5,52.5 50.65,53.35 J7.28
  other vias: 52,40.5
N$37
  Top 0.15: Y1.3 40.2,76 R25.1
N$38
  Top 0.15: U9.1 33.52,75 33.52,74.5 | 33.52,74.5 33.52,73.5 R24.2 | R25.2 37,75 36.5,74.5 33.52,74.5
N$39
  Top 0.15: R39.1 29.5,70 30,70.5 30,73 30,73.03 30,81 30.4,81.4 U9.8
N$40  (via drill 0.25)
  Top 0.15: R38.1 v81.5,67.5 | U9.3 34.83,76.83 v35,77
  Bottom 0.15: v81.5,67.5 81.5,77.5 81,78 72.5,78 72,78.5 72,82.5 70,84.5 35.5,84.5 35,84 v35,77
N$59  (via drill 0.25)
  Top 0.15: J8.9 v93.75,78
  Bottom 0.15: v93.75,78 93.75,66.25 94.5,65.5 TP16.TP
  other vias: 98.5,65.5
N$60  (via drill 0.25)
  Top 0.15: J8.17 v89.75,78
  Bottom 0.15: v89.75,78 89.75,69.75 89,69 TP17.TP
  other vias: 86.5,69
N$61
  Top 0.15: TP18.TP 22.5,71 14,71 13.75,71.25 J9.9
N$62
  Top 0.15: TP19.TP 9.5,70 9.75,70.25 J9.17
NO_COPPER
  cutout Bottom: 38,7.5 38,0 59.5,0 59.5,7.5
  cutout Top: 38,7.5 38,0 59.5,0 59.5,7.5
  cutout Route2: 38,7.5 38,0 59.5,0 59.5,7.5
  cutout Route3: 38,7.5 38,0 59.5,0 59.5,7.5
PWM1  (via drill 0.25)
  Top 0.15: U6.4 62.02,46.02 62.5,46.5 v63.5,46.5 64,47 R6.1
  Bottom 0.15: J2.29 72.95,46.95 72.5,46.5 v63.5,46.5
PWM2  (via drill 0.25)
  Top 0.15: U6.3 62.67,45.67 63,46 v65.5,46 R5.1
  Bottom 0.15: J2.30 77.05,46.55 76.5,46 v65.5,46
RST1  (via drill 0.25)
  Top 0.15: U3.7 64.53,35 65.03,35.5 71.5,35.5 72,36 72,44.5 71.5,45 v71,45
  Bottom 0.15: J2.31 v71,45
RST2  (via drill 0.25)
  Top 0.15: U3.6 65.17,34.67 65.5,35 72,35 72.5,35.5 72.5,44.5 73,45 v75,45
  Bottom 0.15: J2.32 v75,45
SPI0_CS  (via drill 0.25)
  Top 0.15: v70,65.53 U2.4
  Bottom 0.15: J2.12 77.05,64.55 76.5,64 70.5,64 70,64.5 v70,65.53
SPI0_CS1  (via drill 0.25)
  Top 0.15: U3.8 63.88,35.38 64.5,36 67,36 67.5,36.5 v67.5,47.5
  Bottom 0.15: J2.26 77.05,50.55 76.5,50 68,50 67.5,49.5 v67.5,47.5
SPI0_CS2  (via drill 0.25)
  Top 0.15: U3.9 63.23,35.73 64,36.5 66.5,36.5 67,37 v67,47
  Bottom 0.15: J2.25 67.5,51 67,50.5 v67,47
SPI0_DIN  (via drill 0.25)
  Top 0.15: v71,66.83 U2.6
  Bottom 0.15: J2.10 77.05,66.55 76.5,66 71.5,66 71,66.5 v71,66.83
SPI0_DOUT  (via drill 0.25)
  Top 0.15: U2.1 68.92,63.58 69.5,63 v69.5,62
  Bottom 0.15: J2.14 77.05,62.55 76.5,62 v69.5,62
SPI0_SCLK  (via drill 0.25)
  Top 0.15: v71,67.47 U2.7
  Bottom 0.15: J2.8 77.05,68.55 76.5,68 71.5,68 71,67.5 v71,67.47
SPI_CS  (via drill 0.25)
  Top 0.15: U2.17 v55,65.53 | J3.3 v55,21.08
  Bottom 0.15: v55,65.53 v55,21.08
SPI_CS1  (via drill 0.25)
  Top 0.15: J4.3 37.58,63.42 38,63 38,47.5 38.5,47 v62,47 | v62,25 63.5,25 63.88,25.38 U3.13
  Bottom 0.15: v62,47 v62,25
SPI_CS2  (via drill 0.25)
  Top 0.15: U3.12 63.23,25.73 63,25.5 v60.5,25.5 | v60.5,14.5 64.53,14.5 U7.1
  Bottom 0.15: v60.5,25.5 v60.5,14.5
SPI_MISO  (via drill 0.25)
  Top 0.15: J4.5 36.66,58.34 37,58 37,45.5 37.5,45 v60,45 | U2.15 v60,66.83 | U7.6 65.83,21.68 65.5,22 v60,22 | J3.5 v60,26.16
  Bottom 0.15: v60,66.83 v60,45 v60,26.16 v60,22
SPI_MOSI  (via drill 0.25)
  Top 0.15: U2.20 v58.5,63.58 | v58.5,22.5 65.97,22.5 66.47,22 U7.5 | J4.6 36.2,55.8 36.5,55.5 36.5,45 37,44.5 v58.5,44.5 | J3.6 v58.5,28.7
  Bottom 0.15: v58.5,63.58 v58.5,44.5 v58.5,28.7 v58.5,22.5
SPI_SCK  (via drill 0.25)
  Top 0.15: J4.4 37.12,60.88 37.5,60.5 37.5,46 38,45.5 v59.5,45.5 | U2.14 v59.5,67.47 | J3.4 v59.5,23.62 | U7.7 65.17,21.32 65,21.5 v59.5,21.5
  Bottom 0.15: v59.5,67.47 v59.5,45.5 v59.5,21.5 v59.5,23.62
SYS_DCIN  (via drill 0.25)
  Top 0.15: TP21.TP v77.05,40
  Bottom 0.3: J2.36 v77.05,40 J2.38
UART0_RX  (via drill 0.25)
  Top 0.15: v71,68.62 70.5,68.12 U2.8
  Bottom 0.15: J2.7 71.38,69 v71,68.62
UART0_TX  (via drill 0.25)
  Top 0.15: v70.5,69.28 70,68.78 U2.9
  Bottom 0.15: v70.5,69.28 71.22,70 71.95,70 J2.5
UART1_RX  (via drill 0.25)
  Top 0.15: v69.5,64.88 U2.3
  Bottom 0.15: J2.13 70,63 69.5,63.5 v69.5,64.88
UART1_TX  (via drill 0.25)
  Top 0.15: v70.5,66.17 U2.5
  Bottom 0.15: J2.11 71,65 70.5,65.5 v70.5,66.17
VREF
  Top 0.3: L1.1 61.5,20 61.95,20.45 63,20.45 | 63,20.45 U7.8 | C8.2 63,20.45

### Text on the board
tPlace: R | L | GND | 1 | Ultra96 Expansion / Stereo Vision Front-end / U96-SVM Rev.B | 2 | PWR | RST | S/N
Document: Copyright (C) 2020 Nu-Gate Technology. / All rights reserved. / Licensed under the TAPR Open Hardware / License (www.tapr.org/OHL)